# EAGLE design EasyBMS (EAGLE 9.6.2)
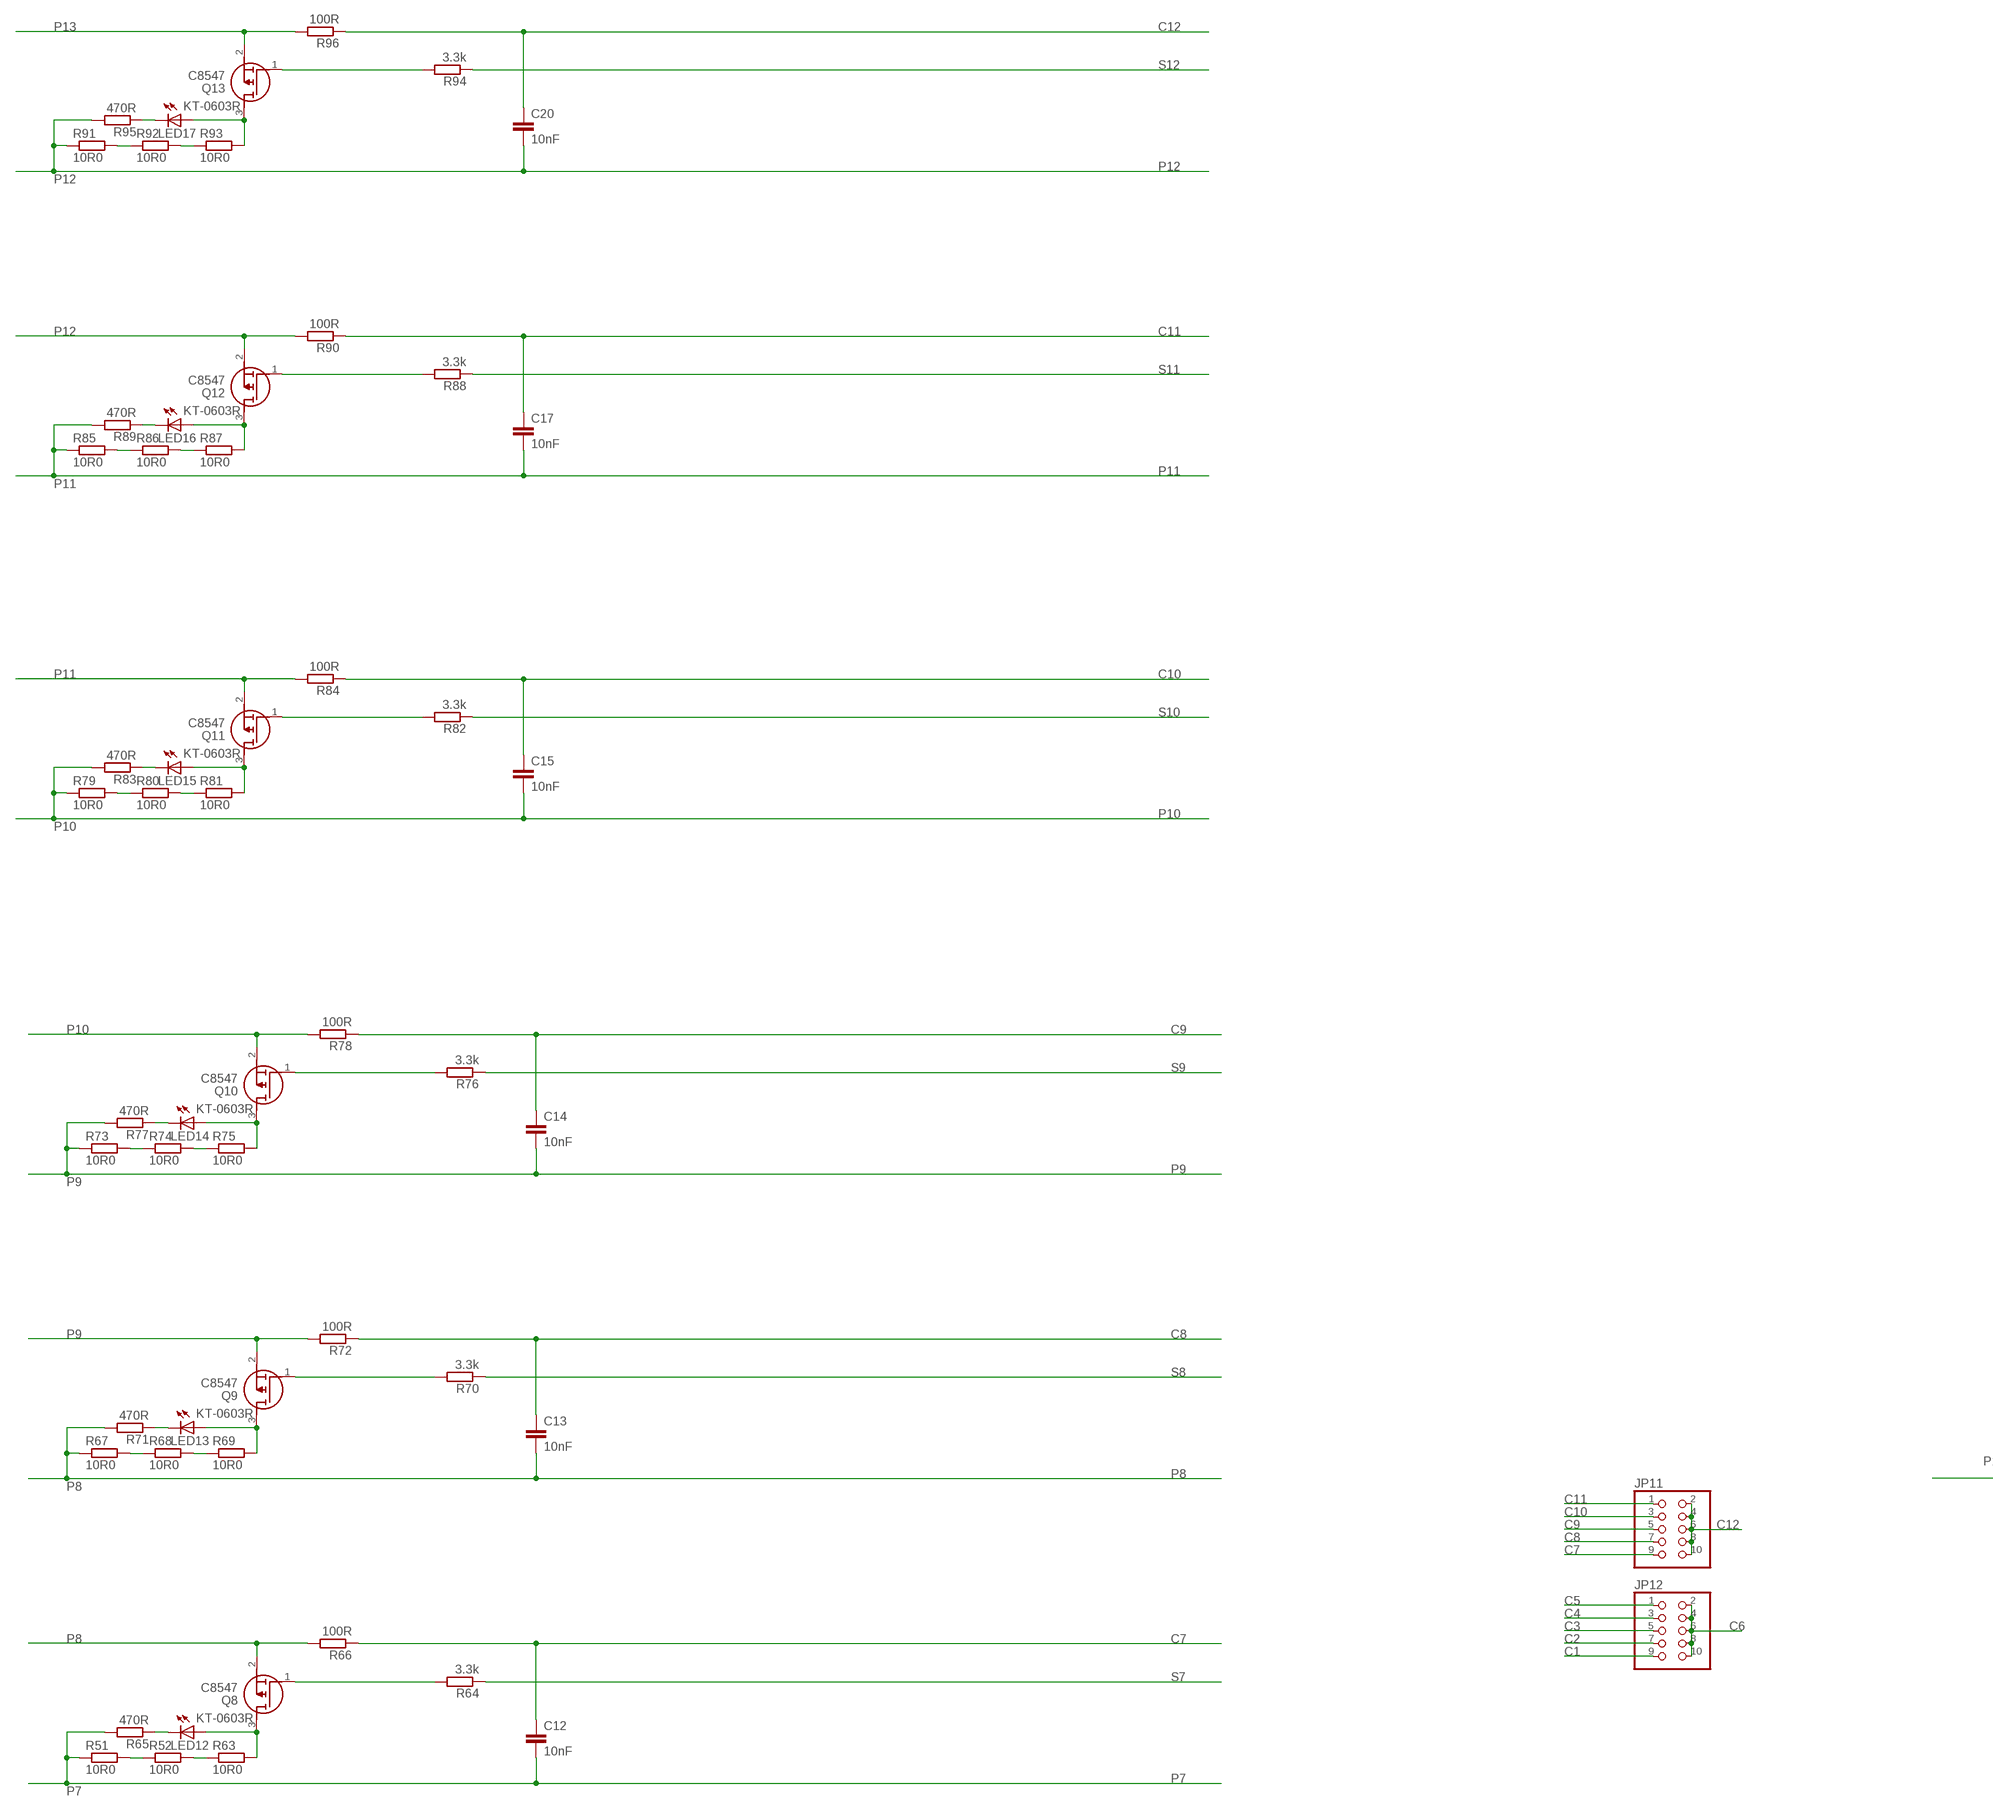
[diagram p0: schematic, sheet 1, part 1 of 3]
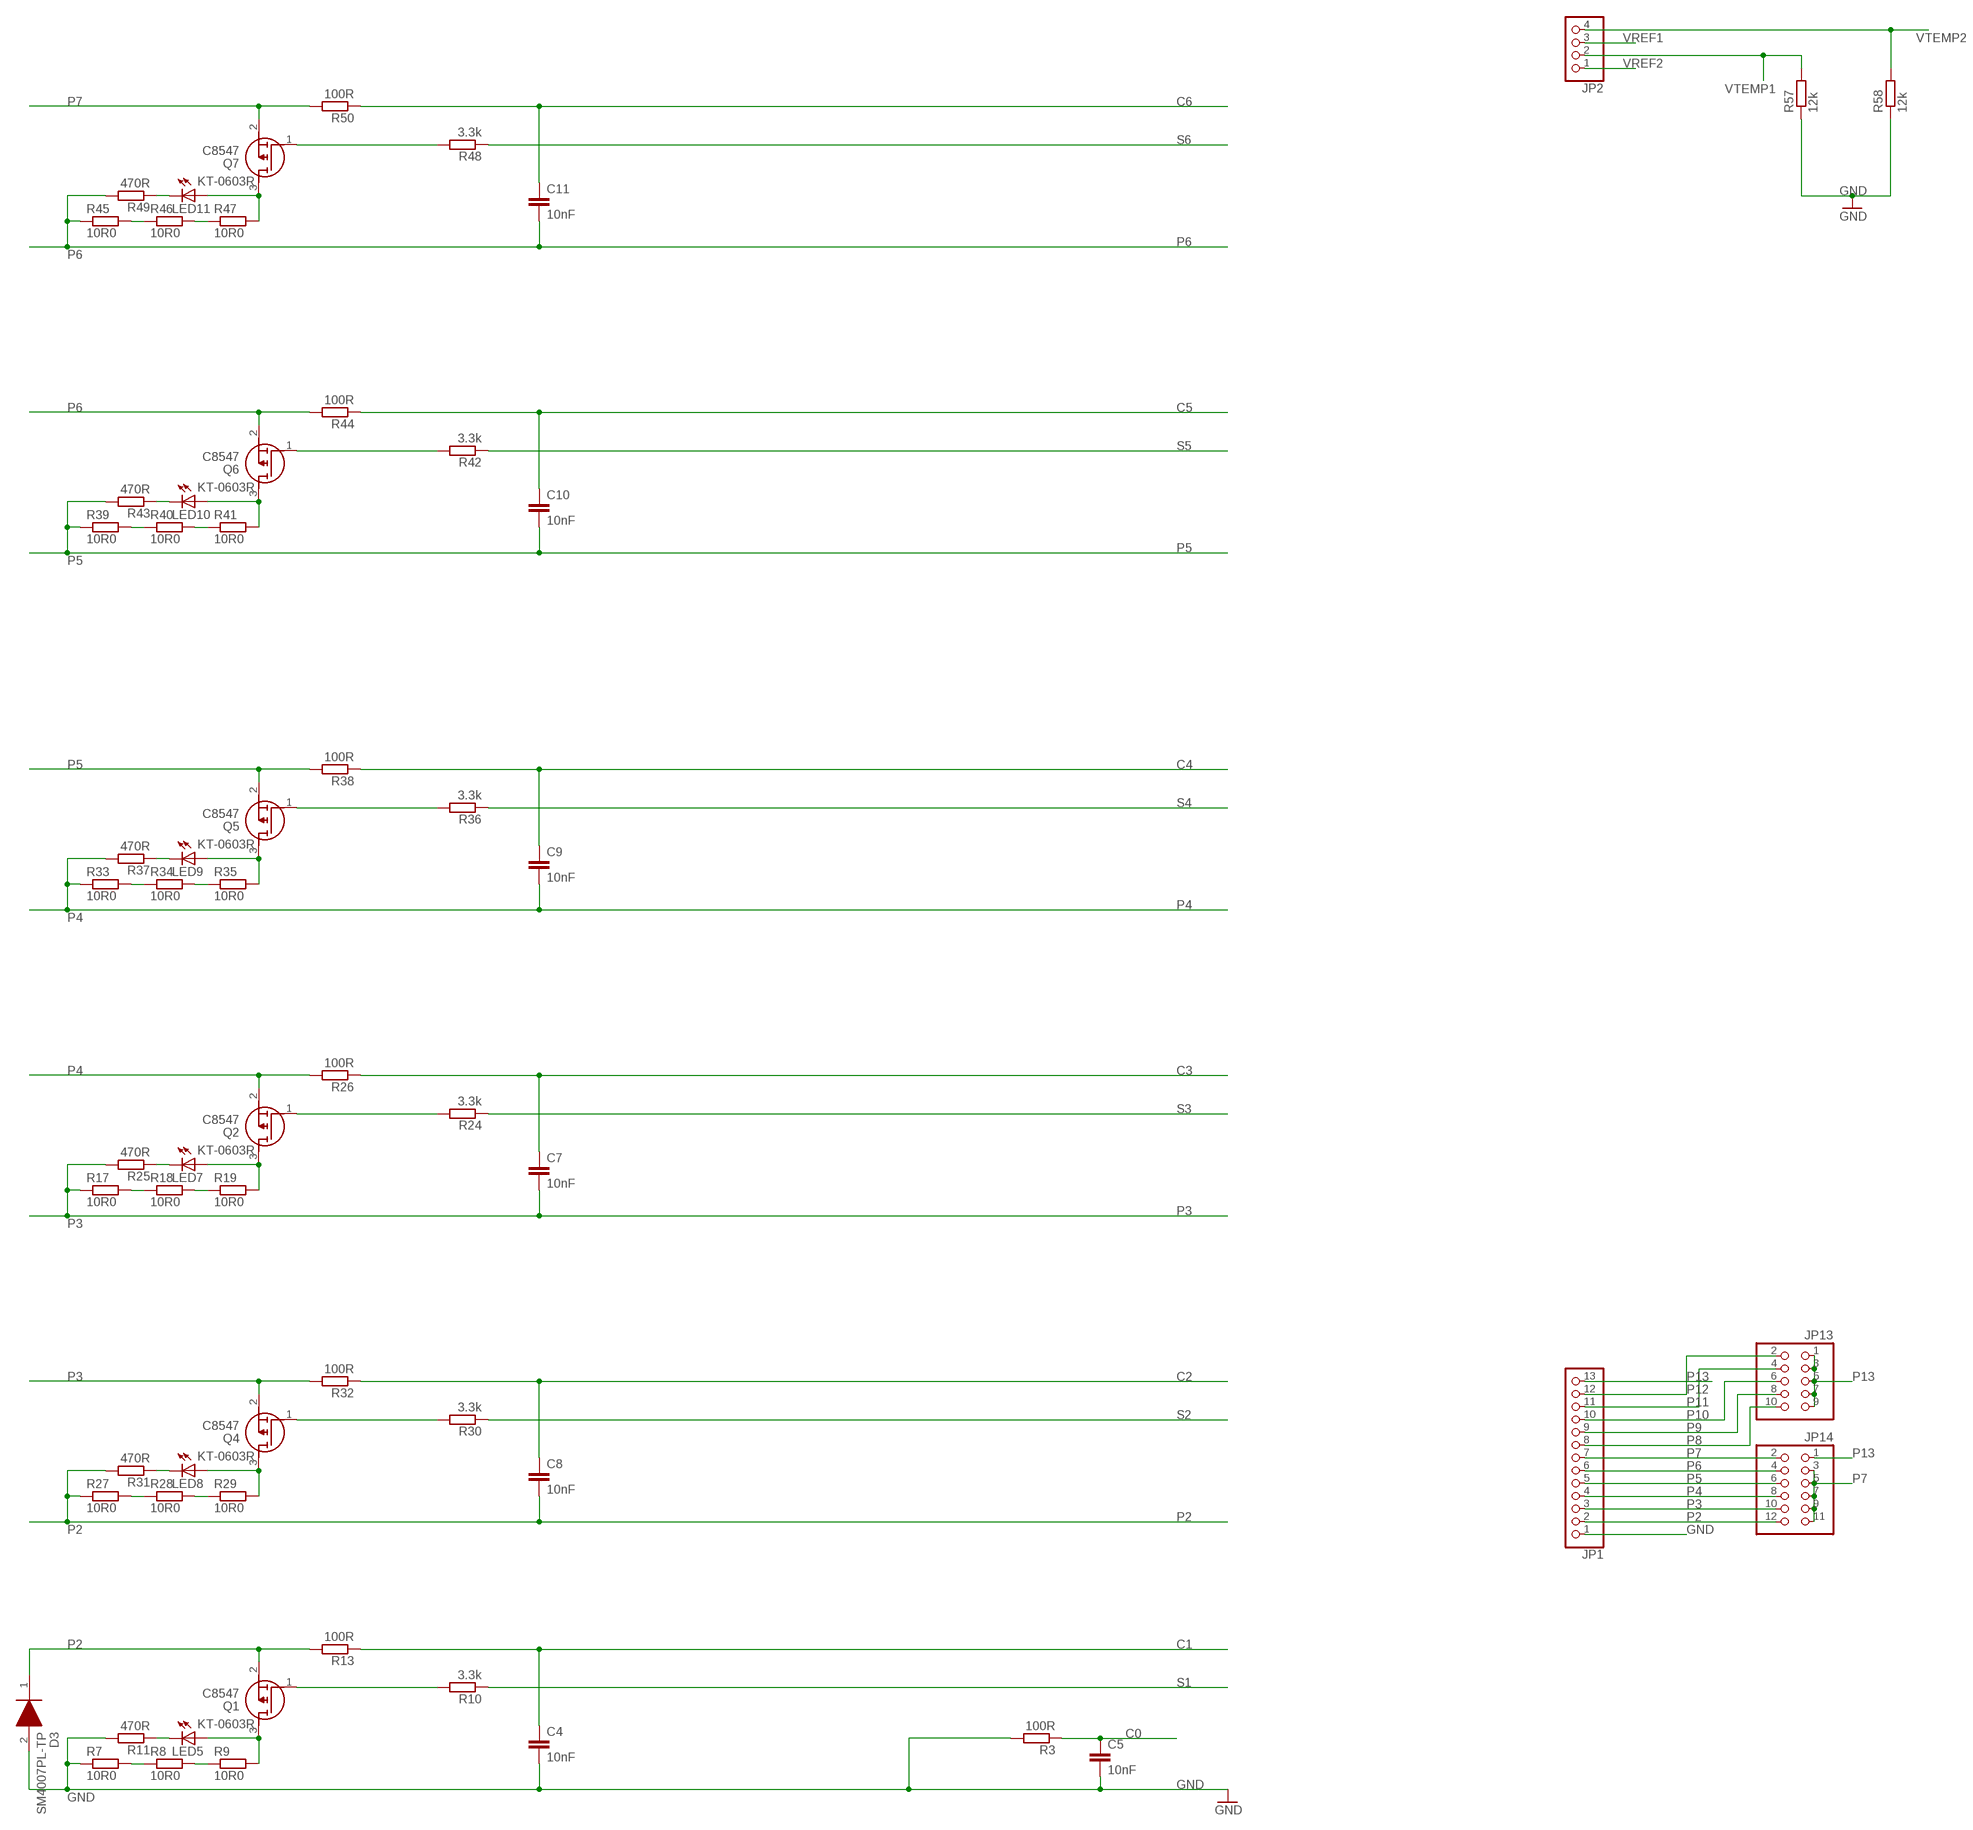
[diagram p1: schematic, sheet 1, part 2 of 3]
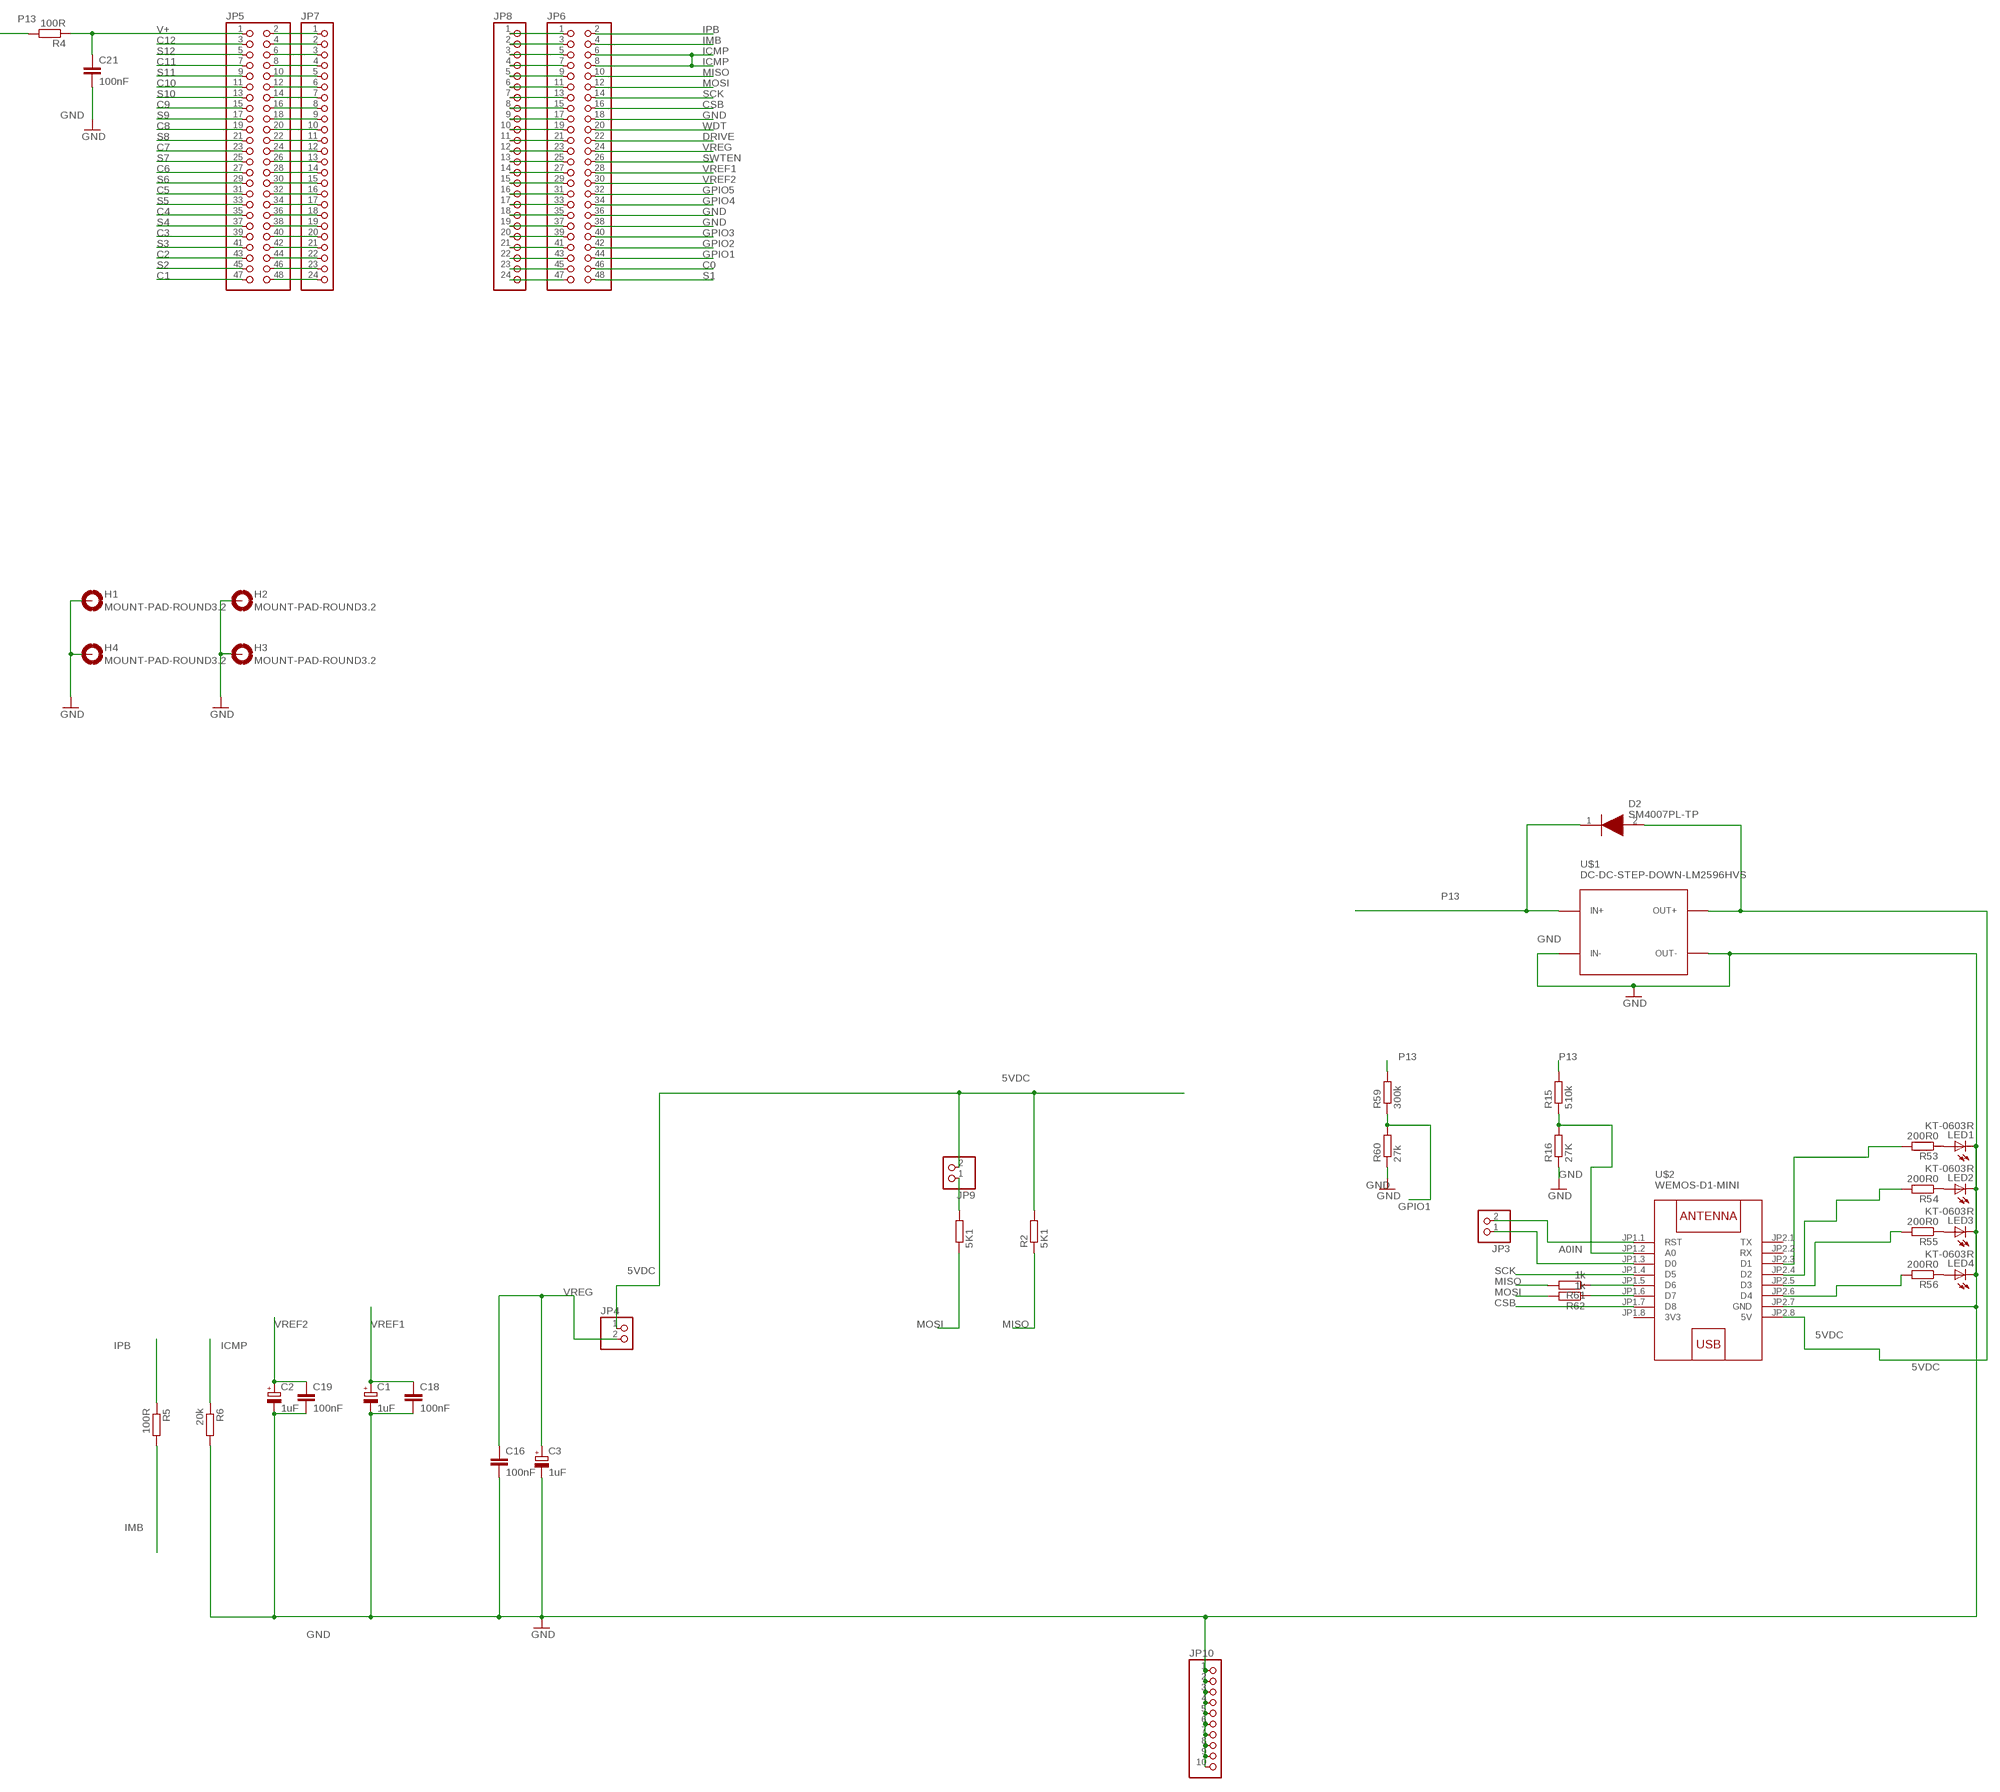
[diagram p2: schematic, sheet 1, part 3 of 3]

## Parts
C1  1uF  CPOL-EUE2.5-6  [E2,5-6]
C2  1uF  CPOL-EUE2.5-6  [E2,5-6]
C3  1uF  CPOL-EUE2.5-6  [E2,5-6]
C4  10nF  C-EUC0402  [C0402]
C5  10nF  C-EUC0402  [C0402]
C7  10nF  C-EUC0402  [C0402]
C8  10nF  C-EUC0402  [C0402]
C9  10nF  C-EUC0402  [C0402]
C10  10nF  C-EUC0402  [C0402]
C11  10nF  C-EUC0402  [C0402]
C12  10nF  C-EUC0402  [C0402]
C13  10nF  C-EUC0402  [C0402]
C14  10nF  C-EUC0402  [C0402]
C15  10nF  C-EUC0402  [C0402]
C16  100nF  C-EUC1206  [C1206]
C17  10nF  C-EUC0402  [C0402]
C18  100nF  C-EUC1206  [C1206]
C19  100nF  C-EUC1206  [C1206]
C20  10nF  C-EUC0402  [C0402]
C21  100nF  C-EUC1206  [C1206]
D2  SM4007PL-TP  [SODFL3616X135N]
D3  SM4007PL-TP  [SODFL3616X135N]
H1  MOUNT-PAD-ROUND3.2  [3,2-PAD]
H2  MOUNT-PAD-ROUND3.2  [3,2-PAD]
H3  MOUNT-PAD-ROUND3.2  [3,2-PAD]
H4  MOUNT-PAD-ROUND3.2  [3,2-PAD]
JP1  PINHD-1X13/90  [1X13/90]
JP2  PINHD-1X4/90  [1X04/90]
JP3  PINHD-1X2  [1X02]
JP4  PINHD-1X2  [1X02]
JP5  PINHD-2X24  [2X24]
JP6  PINHD-2X24  [2X24]
JP7  PINHD-1X24  [1X24]
JP8  PINHD-1X24  [1X24]
JP9  PINHD-1X2  [1X02]
JP10  PINHD-1X10  [1X10]
JP11  PINHD-2X5  [2X05]
JP12  PINHD-2X5  [2X05]
JP13  PINHD-2X5  [2X05]
JP14  PINHD-2X6  [2X06]
LED1  KT-0603R  LEDCHIPLED_0603  [CHIPLED_0603]
LED2  KT-0603R  LEDCHIPLED_0603  [CHIPLED_0603]
LED3  KT-0603R  LEDCHIPLED_0603  [CHIPLED_0603]
LED4  KT-0603R  LEDCHIPLED_0603  [CHIPLED_0603]
LED5  KT-0603R  LEDCHIPLED_0603  [CHIPLED_0603]
LED7  KT-0603R  LEDCHIPLED_0603  [CHIPLED_0603]
LED8  KT-0603R  LEDCHIPLED_0603  [CHIPLED_0603]
LED9  KT-0603R  LEDCHIPLED_0603  [CHIPLED_0603]
LED10  KT-0603R  LEDCHIPLED_0603  [CHIPLED_0603]
LED11  KT-0603R  LEDCHIPLED_0603  [CHIPLED_0603]
LED12  KT-0603R  LEDCHIPLED_0603  [CHIPLED_0603]
LED13  KT-0603R  LEDCHIPLED_0603  [CHIPLED_0603]
LED14  KT-0603R  LEDCHIPLED_0603  [CHIPLED_0603]
LED15  KT-0603R  LEDCHIPLED_0603  [CHIPLED_0603]
LED16  KT-0603R  LEDCHIPLED_0603  [CHIPLED_0603]
LED17  KT-0603R  LEDCHIPLED_0603  [CHIPLED_0603]
Q1  C8547  BSS308PEH6327XTSA1  [PG-SOT-23]
Q2  C8547  BSS308PEH6327XTSA1  [PG-SOT-23]
Q4  C8547  BSS308PEH6327XTSA1  [PG-SOT-23]
Q5  C8547  BSS308PEH6327XTSA1  [PG-SOT-23]
Q6  C8547  BSS308PEH6327XTSA1  [PG-SOT-23]
Q7  C8547  BSS308PEH6327XTSA1  [PG-SOT-23]
Q8  C8547  BSS308PEH6327XTSA1  [PG-SOT-23]
Q9  C8547  BSS308PEH6327XTSA1  [PG-SOT-23]
Q10  C8547  BSS308PEH6327XTSA1  [PG-SOT-23]
Q11  C8547  BSS308PEH6327XTSA1  [PG-SOT-23]
Q12  C8547  BSS308PEH6327XTSA1  [PG-SOT-23]
Q13  C8547  BSS308PEH6327XTSA1  [PG-SOT-23]
R1  5K1  R-EU_R0603  [R0603]
R2  5K1  R-EU_R0603  [R0603]
R3  100R  R-EU_R0402  [R0402]
R4  100R  R-EU_R0402  [R0402]
R5  100R  R-EU_R0402  [R0402]
R6  20k  R-EU_R0603  [R0603]
R7  10R0  R-EU_R1206  [R1206]
R8  10R0  R-EU_R1206  [R1206]
R9  10R0  R-EU_R1206  [R1206]
R10  3.3k  R-EU_R0402  [R0402]
R11  470R  R-EU_R0402  [R0402]
R13  100R  R-EU_R0402  [R0402]
R15  510k  R-EU_R0603  [R0603]
R16  27K  R-EU_R0603  [R0603]
R17  10R0  R-EU_R1206  [R1206]
R18  10R0  R-EU_R1206  [R1206]
R19  10R0  R-EU_R1206  [R1206]
R24  3.3k  R-EU_R0402  [R0402]
R25  470R  R-EU_R0402  [R0402]
R26  100R  R-EU_R0402  [R0402]
R27  10R0  R-EU_R1206  [R1206]
R28  10R0  R-EU_R1206  [R1206]
R29  10R0  R-EU_R1206  [R1206]
R30  3.3k  R-EU_R0402  [R0402]
R31  470R  R-EU_R0402  [R0402]
R32  100R  R-EU_R0402  [R0402]
R33  10R0  R-EU_R1206  [R1206]
R34  10R0  R-EU_R1206  [R1206]
R35  10R0  R-EU_R1206  [R1206]
R36  3.3k  R-EU_R0402  [R0402]
R37  470R  R-EU_R0402  [R0402]
R38  100R  R-EU_R0402  [R0402]
R39  10R0  R-EU_R1206  [R1206]
R40  10R0  R-EU_R1206  [R1206]
R41  10R0  R-EU_R1206  [R1206]
R42  3.3k  R-EU_R0402  [R0402]
R43  470R  R-EU_R0402  [R0402]
R44  100R  R-EU_R0402  [R0402]
R45  10R0  R-EU_R1206  [R1206]
R46  10R0  R-EU_R1206  [R1206]
R47  10R0  R-EU_R1206  [R1206]
R48  3.3k  R-EU_R0402  [R0402]
R49  470R  R-EU_R0402  [R0402]
R50  100R  R-EU_R0402  [R0402]
R51  10R0  R-EU_R1206  [R1206]
R52  10R0  R-EU_R1206  [R1206]
R53  200R0  R-EU_R0603  [R0603]
R54  200R0  R-EU_R0603  [R0603]
R55  200R0  R-EU_R0603  [R0603]
R56  200R0  R-EU_R0603  [R0603]
R57  12k  R-EU_R0603  [R0603]
R58  12k  R-EU_R0603  [R0603]
R59  300k  R-EU_R0603  [R0603]
R60  27k  R-EU_R0603  [R0603]
R61  1k  R-EU_R0603  [R0603]
R62  1k  R-EU_R0603  [R0603]
R63  10R0  R-EU_R1206  [R1206]
R64  3.3k  R-EU_R0402  [R0402]
R65  470R  R-EU_R0402  [R0402]
R66  100R  R-EU_R0402  [R0402]
R67  10R0  R-EU_R1206  [R1206]
R68  10R0  R-EU_R1206  [R1206]
R69  10R0  R-EU_R1206  [R1206]
R70  3.3k  R-EU_R0402  [R0402]
R71  470R  R-EU_R0402  [R0402]
R72  100R  R-EU_R0402  [R0402]
R73  10R0  R-EU_R1206  [R1206]
R74  10R0  R-EU_R1206  [R1206]
R75  10R0  R-EU_R1206  [R1206]
R76  3.3k  R-EU_R0402  [R0402]
R77  470R  R-EU_R0402  [R0402]
R78  100R  R-EU_R0402  [R0402]
R79  10R0  R-EU_R1206  [R1206]
R80  10R0  R-EU_R1206  [R1206]
R81  10R0  R-EU_R1206  [R1206]
R82  3.3k  R-EU_R0402  [R0402]
R83  470R  R-EU_R0402  [R0402]
R84  100R  R-EU_R0402  [R0402]
R85  10R0  R-EU_R1206  [R1206]
R86  10R0  R-EU_R1206  [R1206]
R87  10R0  R-EU_R1206  [R1206]
R88  3.3k  R-EU_R0402  [R0402]
R89  470R  R-EU_R0402  [R0402]
R90  100R  R-EU_R0402  [R0402]
R91  10R0  R-EU_R1206  [R1206]
R92  10R0  R-EU_R1206  [R1206]
R93  10R0  R-EU_R1206  [R1206]
R94  3.3k  R-EU_R0402  [R0402]
R95  470R  R-EU_R0402  [R0402]
R96  100R  R-EU_R0402  [R0402]
U$1  DC-DC-STEP-DOWN-LM2596HVS  [DC-DC-STEP-DOWN-LM2596HVS]
U$2  WEMOS-D1-MINI  [WEMOS-D1-MINI]

## Nets
5VDC: D2.2(A) JP4.1 JP9.2 R2.2 U$1.OUT+ U$2.JP2.8(5V)
A0IN: R15.1 R16.2 U$2.JP1.2(A0)
C0: C5.1 JP6.46 R3.1
C1: C4.1 JP5.47 JP12.9 R13.1
C2: C8.1 JP5.43 JP12.7 R32.1
C3: C7.1 JP5.39 JP12.5 R26.1
C4: C9.1 JP5.35 JP12.3 R38.1
C5: C10.1 JP5.31 JP12.1 R44.1
C6: C11.1 JP5.27 JP12.2 JP12.4 JP12.6 JP12.8 JP12.10 R50.1
C7: C12.1 JP5.23 JP11.9 R66.1
C8: C13.1 JP5.19 JP11.7 R72.1
C9: C14.1 JP5.15 JP11.5 R78.1
C10: C15.1 JP5.11 JP11.3 R84.1
C11: C17.1 JP5.7 JP11.1 R90.1
C12: C20.1 JP5.3 JP11.2 JP11.4 JP11.6 JP11.8 JP11.10 R96.1
CSB: JP6.16 U$2.JP1.7(D8)
DRIVE: JP6.22
GND: C1.- C2.- C3.- C4.2 C5.2 C16.2 C18.2 C19.2 C21.2 D3.2(A) H1.B3,2(MOUNT) H2.B3,2(MOUNT) H3.B3,2(MOUNT) H4.B3,2(MOUNT) JP1.1 JP6.18 JP6.36 JP6.38 JP10.1 JP10.2 JP10.3 JP10.4 JP10.5 JP10.6 JP10.7 JP10.8 JP10.9 JP10.10 LED1.C LED2.C LED3.C LED4.C R3.2 R6.2 R7.1 R11.2 R16.1 R57.1 R58.1 R60.1 U$1.IN- U$1.OUT- U$2.JP2.7(GND)
GPIO1: JP6.44 R59.1 R60.2
GPIO2: JP6.42
GPIO3: JP6.40
GPIO4: JP6.34
GPIO5: JP6.32
ICMP: JP6.6 JP6.8 R6.1
IMB: JP6.4 R5.2
IPB: JP6.2 R5.1
MISO: JP6.10 R2.1 R61.2
MOSI: JP6.12 R1.1 R62.2
N$1: LED1.A R53.1
N$2: LED2.A R54.1
N$3: LED3.A R55.1
N$4: LED4.A R56.1
N$5: JP3.2 U$2.JP1.1(RST)
N$6: JP3.1 U$2.JP1.3(D0)
N$7: JP5.48 JP7.24
N$8: JP5.46 JP7.23
N$9: JP5.44 JP7.22
N$10: JP5.42 JP7.21
N$11: JP5.40 JP7.20
N$12: JP5.38 JP7.19
N$13: JP5.36 JP7.18
N$17: R7.2 R8.1
N$18: R8.2 R9.1
N$21: JP5.34 JP7.17
N$23: LED5.A Q1.3(D) R9.2
N$24: JP5.32 JP7.16
N$25: Q1.1(G) R10.2
N$26: LED5.C R11.1
N$27: R17.2 R18.1
N$28: R18.2 R19.1
N$29: LED7.A Q2.3(D) R19.2
N$30: R56.2 U$2.JP2.6(D4)
N$31: Q2.1(G) R24.2
N$32: LED7.C R25.1
N$33: R27.2 R28.1
N$34: R28.2 R29.1
N$35: LED8.A Q4.3(D) R29.2
N$36: Q4.1(G) R30.2
N$37: LED8.C R31.1
N$38: R33.2 R34.1
N$39: R34.2 R35.1
N$40: LED9.A Q5.3(D) R35.2
N$41: Q5.1(G) R36.2
N$42: LED9.C R37.1
N$43: R39.2 R40.1
N$44: R40.2 R41.1
N$45: LED10.A Q6.3(D) R41.2
N$46: Q6.1(G) R42.2
N$47: LED10.C R43.1
N$48: R45.2 R46.1
N$49: R46.2 R47.1
N$50: LED11.A Q7.3(D) R47.2
N$51: Q7.1(G) R48.2
N$52: LED11.C R49.1
N$53: R51.2 R52.1
N$54: R52.2 R63.1
N$55: LED12.A Q8.3(D) R63.2
N$56: Q8.1(G) R64.2
N$57: LED12.C R65.1
N$58: R67.2 R68.1
N$59: R68.2 R69.1
N$60: LED13.A Q9.3(D) R69.2
N$61: JP5.30 JP7.15
N$62: Q9.1(G) R70.2
N$63: LED13.C R71.1
N$64: R73.2 R74.1
N$65: R74.2 R75.1
N$66: LED14.A Q10.3(D) R75.2
N$67: Q10.1(G) R76.2
N$68: LED14.C R77.1
N$69: R79.2 R80.1
N$70: R53.2 U$2.JP2.3(D1)
N$71: R80.2 R81.1
N$72: LED15.A Q11.3(D) R81.2
N$73: R61.1 U$2.JP1.5(D6)
N$74: JP5.28 JP7.14
N$75: JP5.26 JP7.13
N$76: JP5.24 JP7.12
N$77: JP5.22 JP7.11
N$78: JP5.20 JP7.10
N$79: Q11.1(G) R82.2
N$80: LED15.C R83.1
N$81: R85.2 R86.1
N$82: R86.2 R87.1
N$83: LED16.A Q12.3(D) R87.2
N$84: JP5.18 JP7.9
N$85: JP5.16 JP7.8
N$86: JP5.14 JP7.7
N$87: JP5.12 JP7.6
N$88: JP5.10 JP7.5
N$89: JP5.8 JP7.4
N$90: JP5.6 JP7.3
N$91: JP5.4 JP7.2
N$92: JP6.47 JP8.24
N$93: JP6.45 JP8.23
N$94: JP6.43 JP8.22
N$95: JP6.41 JP8.21
N$96: JP6.39 JP8.20
N$97: JP6.37 JP8.19
N$98: JP6.35 JP8.18
N$99: JP6.33 JP8.17
N$100: JP6.31 JP8.16
N$101: JP6.29 JP8.15
N$102: JP6.27 JP8.14
N$103: JP6.25 JP8.13
N$104: JP6.23 JP8.12
N$105: JP6.21 JP8.11
N$107: JP6.19 JP8.10
N$108: JP6.17 JP8.9
N$109: JP6.15 JP8.8
N$110: JP6.13 JP8.7
N$111: JP6.11 JP8.6
N$112: JP6.9 JP8.5
N$113: JP6.7 JP8.4
N$114: JP6.5 JP8.3
N$115: JP6.3 JP8.2
N$116: JP6.1 JP8.1
N$117: JP9.1 R1.2
N$118: JP5.2 JP7.1
N$119: R62.1 U$2.JP1.6(D7)
N$120: R55.2 U$2.JP2.5(D3)
N$122: Q12.1(G) R88.2
N$123: LED16.C R89.1
N$124: R54.2 U$2.JP2.4(D2)
N$125: R91.2 R92.1
N$126: R92.2 R93.1
N$127: LED17.A Q13.3(D) R93.2
N$128: Q13.1(G) R94.2
N$129: LED17.C R95.1
P2: C8.2 D3.1(K) JP1.2 JP14.12 Q1.2(S) R13.2 R27.1 R31.2
P3: C7.2 JP1.3 JP14.10 Q4.2(S) R17.1 R25.2 R32.2
P4: C9.2 JP1.4 JP14.8 Q2.2(S) R26.2 R33.1 R37.2
P5: C10.2 JP1.5 JP14.6 Q5.2(S) R38.2 R39.1 R43.2
P6: C11.2 JP1.6 JP14.4 Q6.2(S) R44.2 R45.1 R49.2
P7: C12.2 JP1.7 JP14.2 JP14.3 JP14.5 JP14.7 JP14.9 JP14.11 Q7.2(S) R50.2 R51.1 R65.2
P8: C13.2 JP1.8 JP13.10 Q8.2(S) R66.2 R67.1 R71.2
P9: C14.2 JP1.9 JP13.8 Q9.2(S) R72.2 R73.1 R77.2
P10: C15.2 JP1.10 JP13.6 Q10.2(S) R78.2 R79.1 R83.2
P11: C17.2 JP1.11 JP13.4 Q11.2(S) R84.2 R85.1 R89.2
P12: C20.2 JP1.12 JP13.2 Q12.2(S) R90.2 R91.1 R95.2
P13: D2.1(K) JP1.13 JP13.1 JP13.3 JP13.5 JP13.7 JP13.9 JP14.1 Q13.2(S) R4.2 R15.2 R59.2 R96.2 U$1.IN+
S1: JP6.48 R10.1
S2: JP5.45 R30.1
S3: JP5.41 R24.1
S4: JP5.37 R36.1
S5: JP5.33 R42.1
S6: JP5.29 R48.1
S7: JP5.25 R64.1
S8: JP5.21 R70.1
S9: JP5.17 R76.1
S10: JP5.13 R82.1
S11: JP5.9 R88.1
S12: JP5.5 R94.1
SCK: JP6.14 U$2.JP1.4(D5)
SWTEN: JP6.26
V+: C21.1 JP5.1 R4.1
VREF1: C1.+ C18.1 JP2.3 JP6.28
VREF2: C2.+ C19.1 JP2.1 JP6.30
VREG: C3.+ C16.1 JP4.2 JP6.24
VTEMP1: JP2.2 R57.2
VTEMP2: JP2.4 R58.2
WDT: JP6.20
Unconnected: U$2.JP2.1(TX) U$2.JP2.2(RX)

## Power pins joined to a net without a drawn wire
3V3: U$2.JP1.8(3V3)

## Library data of the parts
C1-C3 = rcl:CPOL-EU: POLARIZED CAPACITOR, European symbol
C4 C5 C7-C21 = rcl:C-EU: CAPACITOR, European symbol
D2 D3 = SamacSys_Parts:SM4007PL-TP: Rectifiers 1A, 1000V 1A, 1000V Source: Datasheet <http://www.mccsemi.com/up_pdf/SM4001PL-SM4007PL(SOD-123FL).PDF>; DESCRIPTION: Rectifiers 1A, 1000V 1A, 1000V; HEIGHT: 1.35mm; MANUFACTURER_NAME: Micro Commercial Components (MCC); MANUFACTURER_PART_NUMBER: SM4007PL-TP; MOUSER_PART_NUMBER: 833-SM4007PL-TP; MOUSER_PRICE-STOCK: https://www.mouser.co.uk/ProductDetail/Micro-Commercial-Components-MCC/SM4007PL-TP?qs=SdqRYZZ9IxCh9ylwm1K3UA%3D%3D
H1-H4 = holes:MOUNT-PAD-ROUND: MOUNTING PAD, round
JP1 = pinhead:PINHD-1X13: PIN HEADER
JP2 = pinhead:PINHD-1X4: PIN HEADER
JP3 JP4 JP9 = pinhead_own:PINHD-1X2: PIN HEADER
JP5 JP6 = pinhead:PINHD-2X24: PIN HEADER
JP7 JP8 = pinhead:PINHD-1X24: PIN HEADER
JP10 = pinhead:PINHD-1X10: PIN HEADER
JP11-JP13 = pinhead:PINHD-2X5: PIN HEADER
JP14 = pinhead:PINHD-2X6: PIN HEADER
LED1-LED5 LED7-LED17 = led:LED: LED OSRAM: - CHIPLED LG R971, LG N971, LY N971, LG Q971, LY Q971, LO R971, LY R971 LH N974, LH R974 LS Q976, LO Q976, LY Q976 LO Q996 - Hyper CHIPLED LW Q18S LB Q993, LB Q99A, LB R99A - SideLED LS A670, LO A670, LY A670, LG A670, LP A670 LB A673, LV A673, LT A673, LW A673 LH A674 LY A675 LS A676, LA A676, LO A676, LY A676, LW A676 LS A679, LY A679, LG A679 - Hyper Micro SIDELED® LS Y876, LA Y876, LO Y876, LY Y876 LT Y87S - SmartLED LW L88C, LW L88S LB L89C, LB L89S, LG L890 LS L89K, LO L89K, LY L89K LS L896, LA L896, LO L896, LY L896 - TOPLED LS T670, LO T670, LY T670, LG T670, LP T670 LSG T670, LSP T670, LSY T670, LOP T670, LYG T670 LG T671, LOG T671, LSG T671 LB T673, LV T673, LT T673, LW T673 LH T674 LS T676, LA T676, LO T676, LY T676, LB T676, LH T676, LSB T676, LW T676 LB T67C, LV T67C, LT T67C, LS T67K, LO T67K, LY T67K, LW E67C LS E67B, LA E67B, LO E67B, LY E67B, LB E67C, LV E67C, LT E67C LW T67C LS T679, LY T679, LG T679 LS T770, LO T770, LY T770, LG T770, LP T770 LB T773, LV T773, LT T773, LW T773 LH T774 LS E675, LA E675, LY E675, LS T675 LS T776, LA T776, LO T776, LY T776, LB T776 LHGB T686 LT T68C, LB T68C - Hyper Mini TOPLED® LB M676 - Mini TOPLED Santana® LG M470 LS M47K, LO M47K, LY M47K Source: http://www.osram.convergy.de LUXEON: - LUMILED® LXK2-PW12-R00, LXK2-PW12-S00, LXK2-PW14-U00, LXK2-PW14-V00 LXK2-PM12-R00, LXK2-PM12-S00, LXK2-PM14-U00 LXK2-PE12-Q00, LXK2-PE12-R00, LXK2-PE12-S00, LXK2-PE14-T00, LXK2-PE14-U00 LXK2-PB12-K00, LXK2-PB12-L00, LXK2-PB12-M00, LXK2-PB14-N00, LXK2-PB14-P00, LXK2-PB14-Q00 LXK2-PR12-L00, LXK2-PR12-M00, LXK2-PR14-Q00, LXK2-PR14-R00 LXK2-PD12-Q00, LXK2-PD12-R00, LXK2-PD12-S00 LXK2-PH12-R00, LXK2-PH12-S00 LXK2-PL12-P00, LXK2-PL12-Q00, LXK2-PL12-R00 Source: www.luxeon.com KINGBRIGHT: KA-3528ASYC Source: www.kingbright.com
Q1 Q2 Q4-Q13 = SamacSys_Parts:BSS308PEH6327XTSA1: Infineon BSS308PEH6327XTSA1 P-channel MOSFET, 1.6 A, 30 V OptiMOS P, 3-Pin SOT-23 Source: Datasheet <https://www.infineon.com/dgdl/Infineon-BSS308PE-DS-v02_03-en.pdf?fileId=db3a304330f686060131099c80400073>; DESCRIPTION: Infineon BSS308PEH6327XTSA1 P-channel MOSFET, 1.6 A, 30 V OptiMOS P, 3-Pin SOT-23; HEIGHT: mm; MANUFACTURER_NAME: Infineon; MANUFACTURER_PART_NUMBER: BSS308PEH6327XTSA1; MOUSER_PART_NUMBER: 726-BSS308PEH6327XTS; MOUSER_PRICE-STOCK: https://www.mouser.co.uk/ProductDetail/Infineon-Technologies/BSS308PEH6327XTSA1?qs=K00xGehIljswKa%252BUULwt9w%3D%3D
R1-R11 R13 R15-R19 R24-R96 = rcl:R-EU_: RESISTOR, European symbol
U$1 = diy-modules:DC-DC-STEP-DOWN-LM2596HVS: DC/DC Step-Down Regulator based on LM2596-ADJ chip LM2596 datasheet available here: http://www.ti.com/lit/ds/symlink/lm2596.pdf Click here to find device on ebay.com <http://www.ebay.com/sch/lm2596+power+regulator>
U$2 = diy-modules:WEMOS-D1-MINI: WEMOS D1 mini: Mini Wi-Fi Board based on ESP-8266 device More details can be found here: https://www.wemos.cc/product/d1-mini.html Click here to find device on ebay.com <http://www.ebay.com/sch/wemos+d1+mini+nodemcu>

## Board
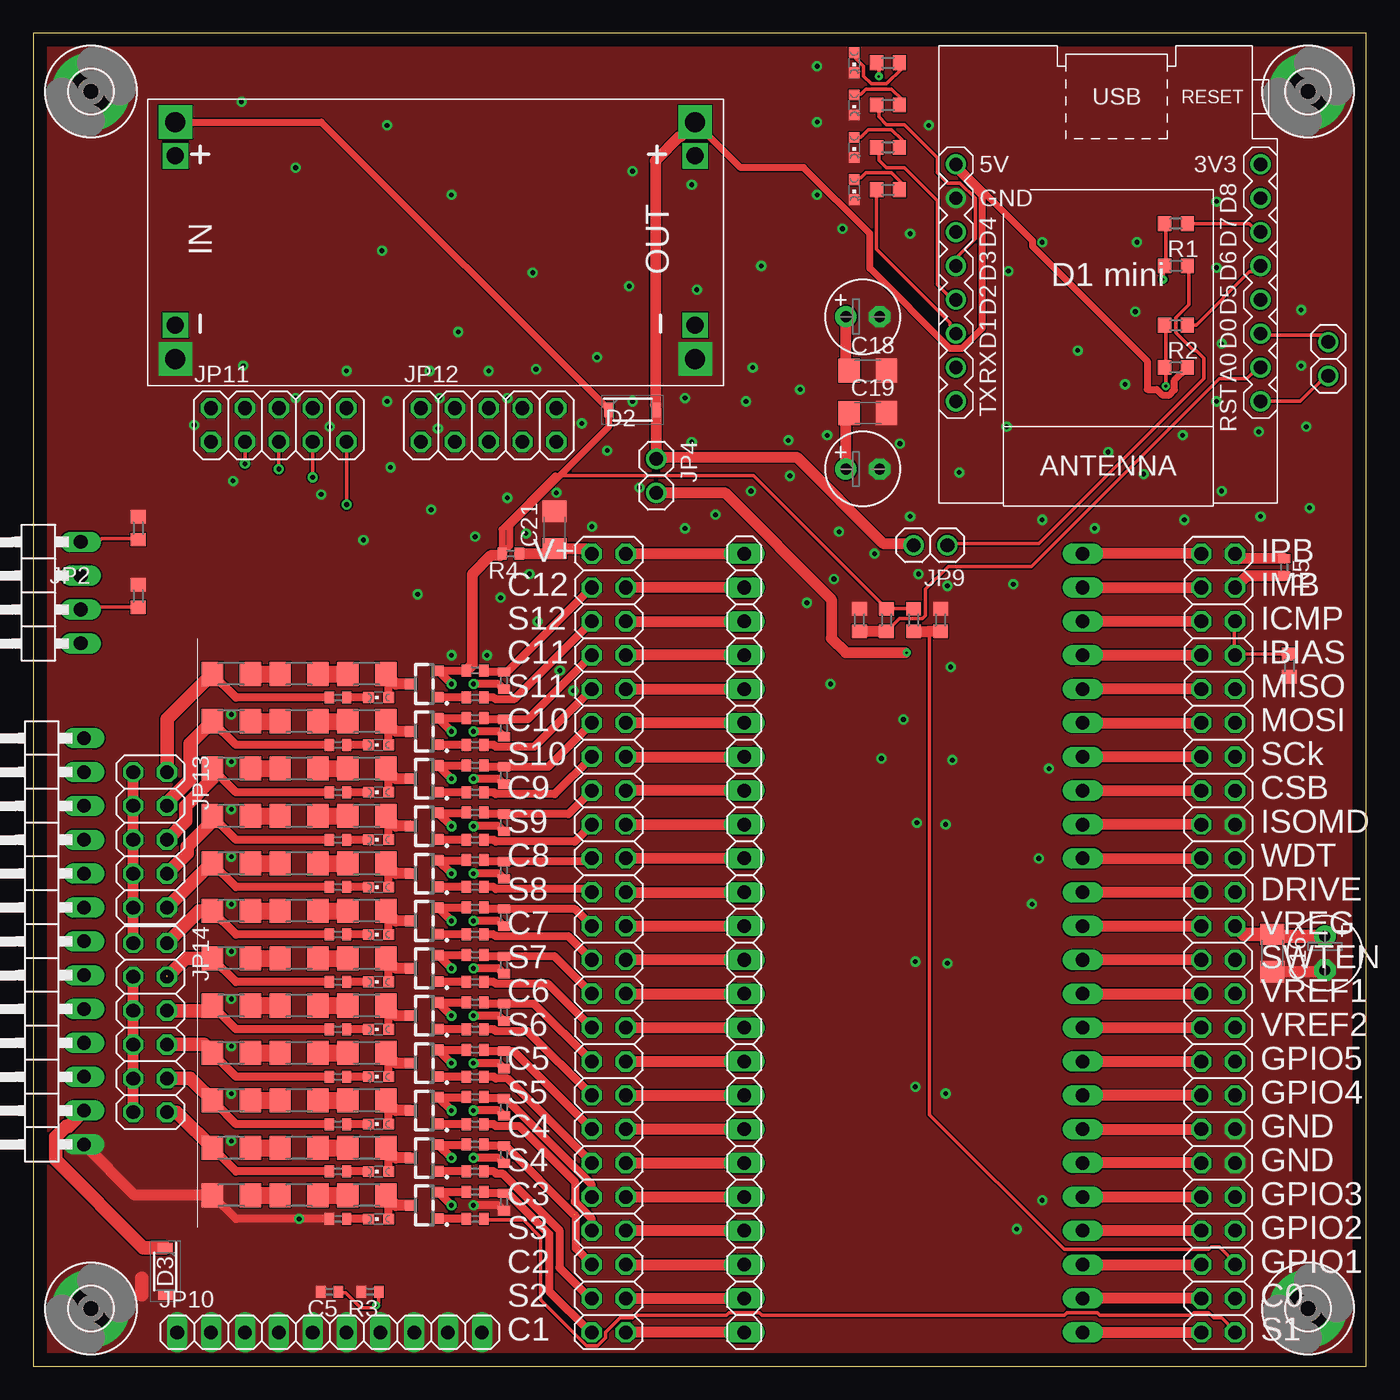
[diagram p3: board, top side]
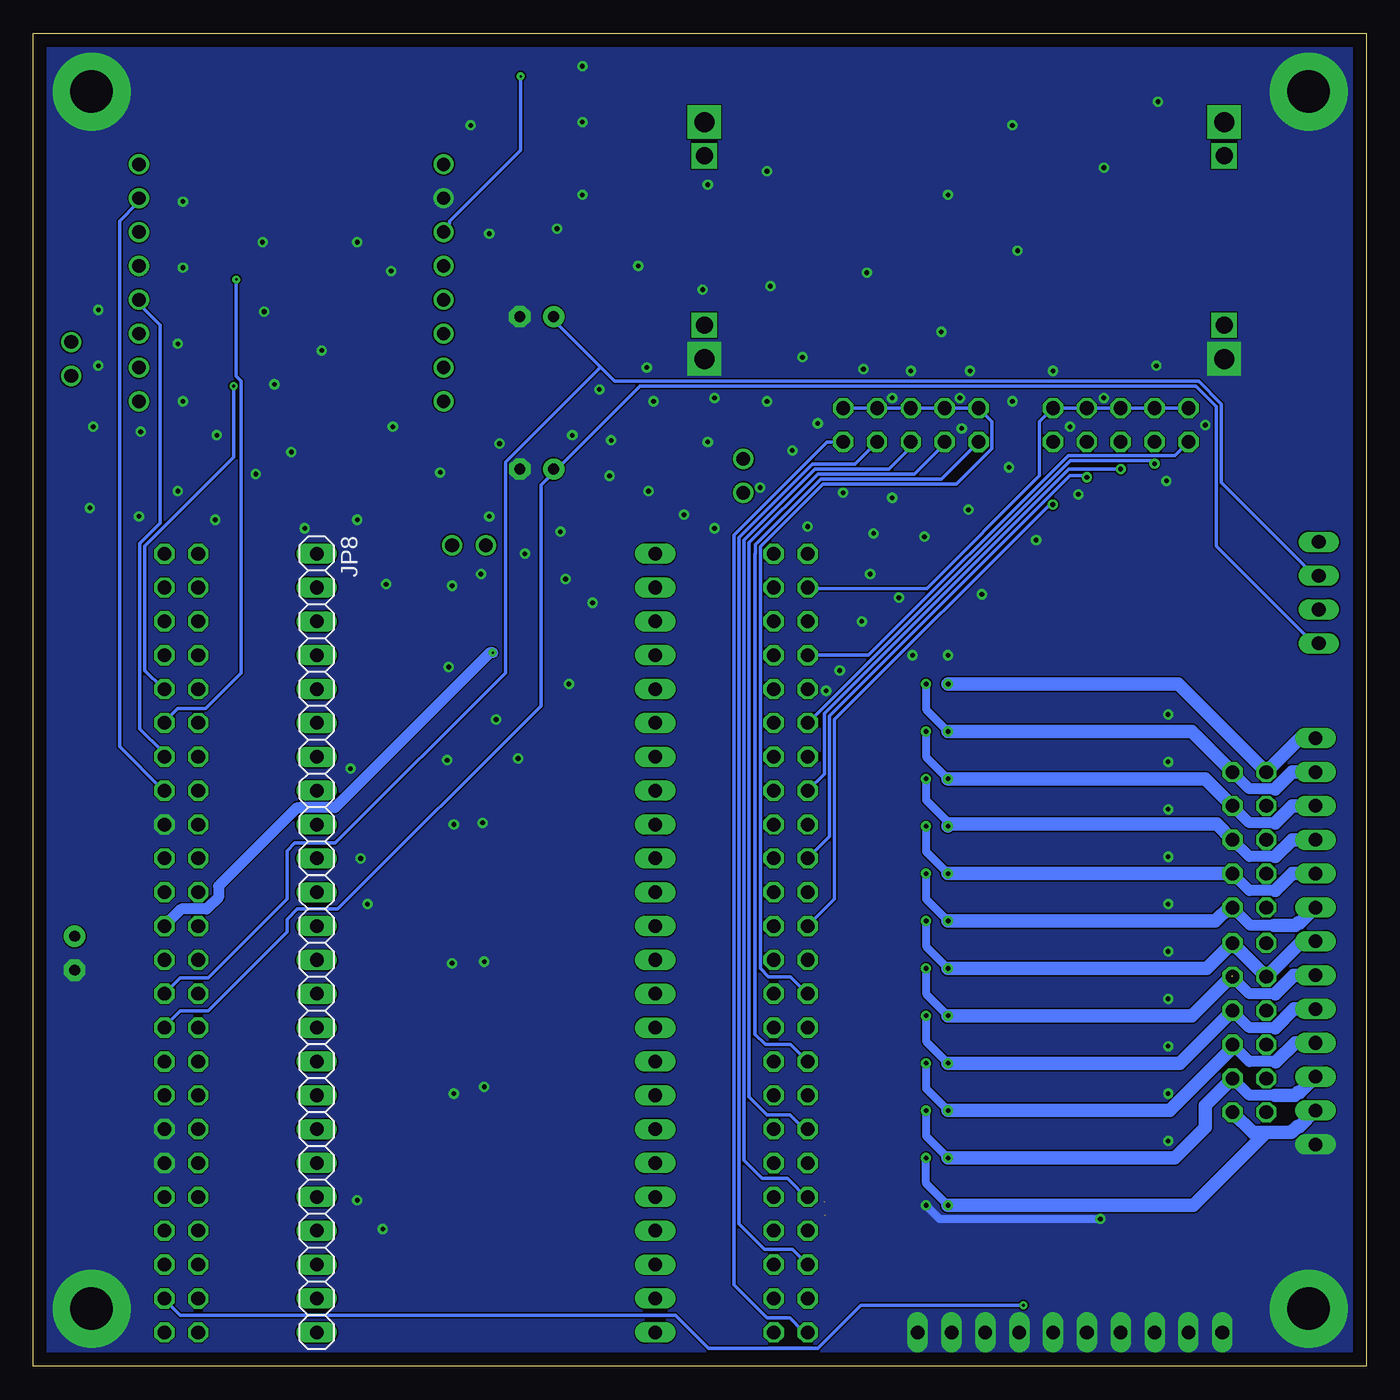
[diagram p4: board, bottom side, seen from below]

Size 100 x 100 mm. Coordinates in mm from the lower left corner, seen from the top.
Outline: 0,100 0,0 100,0 100,100 0,100
Copper layers (1*16): Top 0.035mm / dielectric 1.5mm / Bottom 0.035mm
Design rules "default *": minimum track width 11mil, minimum drill 0.2mm, track to track 4mil, track to pad 4mil, pad to pad 4mil, via to via 4mil, smd to smd 4mil, copper to edge 40mil, drill to drill 6mil, minimum pad ring 10mil, minimum via ring 8mil, stop-mask expansion 4mil, vias tented up to drill 0mil, thermal gap 10mil

### Footprints (pad centres in the part's own frame; a part is rotated, then mirrored left to right if it is on the bottom)
E2,5-6 = drill 0.813 pad 1.6: + -1.27,0 | drill 0.813 pad 1.6 octagon: - 1.27,0
C0402 = smd 0.7 x 0.9: 1 -0.65,0; 2 0.65,0
C1206 = smd 1.6 x 1.8: 1 -1.4,0; 2 1.4,0
SODFL3616X135N = smd 0.74 x 1.07: 1 -1.775,0; 2 1.775,0
3,2-PAD = drill 3.2 pad 5.842: B3,2 0,0
1X13/90 = drill 1.016 long: 1 -15.24,-3.81; 2 -12.7,-3.81; 3 -10.16,-3.81; 4 -7.62,-3.81; 5 -5.08,-3.81; 6 -2.54,-3.81; 7 0,-3.81; 8 2.54,-3.81; 9 5.08,-3.81; 10 7.62,-3.81; 11 10.16,-3.81; 12 12.7,-3.81; 13 15.24,-3.81
1X04/90 = drill 1.016 long: 1 -3.81,-3.81; 2 -1.27,-3.81; 3 1.27,-3.81; 4 3.81,-3.81
1X02 = drill 1.016: 1 -1.27,0; 2 1.27,0
2X24 = drill 1.016 octagon: 1 -27.94,-1.27; 2 -27.94,1.27; 3 -25.4,-1.27; 4 -25.4,1.27; 5 -22.86,-1.27; 6 -22.86,1.27; 7 -20.32,-1.27; 8 -20.32,1.27; 9 -17.78,-1.27; 10 -17.78,1.27; 11 -15.24,-1.27; 12 -15.24,1.27; 13 -12.7,-1.27; 14 -12.7,1.27; 15 -10.16,-1.27; 16 -10.16,1.27; 17 -7.62,-1.27; 18 -7.62,1.27; 19 -5.08,-1.27; 20 -5.08,1.27; 21 -2.54,-1.27; 22 -2.54,1.27; 23 0,-1.27; 24 0,1.27; 25 2.54,-1.27; 26 2.54,1.27; 27 5.08,-1.27; 28 5.08,1.27; 29 7.62,-1.27; 30 7.62,1.27; 31 10.16,-1.27; 32 10.16,1.27; 33 12.7,-1.27; 34 12.7,1.27; 35 15.24,-1.27; 36 15.24,1.27; 37 17.78,-1.27; 38 17.78,1.27; 39 20.32,-1.27; 40 20.32,1.27; 41 22.86,-1.27; 42 22.86,1.27; 43 25.4,-1.27; 44 25.4,1.27; 45 27.94,-1.27; 46 27.94,1.27; 47 30.48,-1.27; 48 30.48,1.27
1X24 = drill 1.016 long: 1 -29.21,0; 2 -26.67,0; 3 -24.13,0; 4 -21.59,0; 5 -19.05,0; 6 -16.51,0; 7 -13.97,0; 8 -11.43,0; 9 -8.89,0; 10 -6.35,0; 11 -3.81,0; 12 -1.27,0; 13 1.27,0; 14 3.81,0; 15 6.35,0; 16 8.89,0; 17 11.43,0; 18 13.97,0; 19 16.51,0; 20 19.05,0; 21 21.59,0; 22 24.13,0; 23 26.67,0; 24 29.21,0
1X10 = drill 1.016 long: 1 -11.43,0; 2 -8.89,0; 3 -6.35,0; 4 -3.81,0; 5 -1.27,0; 6 1.27,0; 7 3.81,0; 8 6.35,0; 9 8.89,0; 10 11.43,0
2X05 = drill 1.016 octagon: 1 -5.08,-1.27; 2 -5.08,1.27; 3 -2.54,-1.27; 4 -2.54,1.27; 5 0,-1.27; 6 0,1.27; 7 2.54,-1.27; 8 2.54,1.27; 9 5.08,-1.27; 10 5.08,1.27
2X06 = drill 1.016 octagon: 1 -6.35,-1.27; 2 -6.35,1.27; 3 -3.81,-1.27; 4 -3.81,1.27; 5 -1.27,-1.27; 6 -1.27,1.27; 7 1.27,-1.27; 8 1.27,1.27; 9 3.81,-1.27; 10 3.81,1.27; 11 6.35,-1.27; 12 6.35,1.27
CHIPLED_0603 = smd 0.8 x 0.8: A 0,-0.75; C 0,0.75
PG-SOT-23 = smd 0.9 x 0.8: 1 1,-1; 2 1,1; 3 -1,0
R0603 = smd 1 x 1.1: 1 -0.85,0; 2 0.85,0
R0402 = smd 0.7 x 0.9: 1 -0.65,0; 2 0.65,0
R1206 = smd 1.6 x 1.803: 1 -1.422,0; 2 1.422,0
DC-DC-STEP-DOWN-LM2596HVS = drill 1.5 pad 2.5 square: IN+ 0,17.78; IN- 0,0; OUT+ 39,17.78; OUT- 39,0 | drill 1.27 pad 1.676 square: P$1 0,15.24; P$6 0,2.54; P$7 39,15.24; P$8 39,2.54
WEMOS-D1-MINI = drill 1: JP1.1 -11.43,9.525; JP1.2 -11.43,6.985; JP1.3 -11.43,4.445; JP1.4 -11.43,1.905; JP1.5 -11.43,-0.635; JP1.6 -11.43,-3.175; JP1.7 -11.43,-5.715; JP1.8 -11.43,-8.255; JP2.1 11.43,9.525; JP2.2 11.43,6.985; JP2.3 11.43,4.445; JP2.4 11.43,1.905; JP2.5 11.43,-0.635; JP2.6 11.43,-3.175; JP2.7 11.43,-5.715; JP2.8 11.43,-8.255

### Placement (x,y rotation side)
C1  62.23,78.74 0 top
C2  62.23,67.31 0 top
C3  96.9,30.99 270 top
C4  35.31,12.32 270 top
C5  22.23,5.59 180 top
C7  35.31,19.43 270 top
C8  35.31,15.88 270 top
C9  35.31,22.99 270 top
C10  35.31,26.54 270 top
C11  35.31,30.1 270 top
C12  35.31,33.66 270 top
C13  35.31,37.21 270 top
C14  35.31,40.77 270 top
C15  35.31,44.32 270 top
C16  92.96,30.99 270 top
C17  35.31,47.88 270 top
C18  62.61,74.68 0 top
C19  62.61,71.5 0 top
C20  35.31,51.44 270 top
C21  39.12,62.74 90 top
D2  44.96,71.75 0 top
D3  9.91,7.11 270 top
H1  4.32,95.63 0 top
H2  95.63,95.63 0 top
H3  4.32,4.32 0 top
H4  95.63,4.32 0 top
JP1  0,31.88 90 top
JP2  -0.25,58.04 90 top
JP3  97.16,75.56 270 top
JP4  46.74,66.8 270 top
JP5  43.18,33.02 270 top
JP6  88.9,33.02 270 top
JP7  53.34,31.75 270 top
JP8  78.74,31.75 270 bottom
JP9  67.31,61.59 180 top
JP10  22.23,2.54 0 top
JP11  18.41,70.61 0 top
JP12  34.16,70.61 0 top
JP13  8.76,39.5 270 top
JP14  8.76,25.4 270 top
LED1  61.59,88.27 180 top
LED2  61.59,91.44 180 top
LED3  61.59,94.61 180 top
LED4  61.59,97.79 180 top
LED5  25.91,11.05 90 top
LED7  25.91,18.16 90 top
LED8  25.91,14.61 90 top
LED9  25.91,21.72 90 top
LED10  25.91,25.27 90 top
LED11  25.91,28.83 90 top
LED12  25.91,32.38 90 top
LED13  25.91,35.94 90 top
LED14  25.91,39.5 90 top
LED15  25.91,43.05 90 top
LED16  25.91,46.61 90 top
LED17  25.91,50.16 90 top
Q1  29.34,12.06 0 top
Q2  29.34,19.18 0 top
Q4  29.34,15.62 0 top
Q5  29.34,22.73 0 top
Q6  29.34,26.29 0 top
Q7  29.34,29.84 0 top
Q8  29.34,33.4 0 top
Q9  29.34,36.96 0 top
Q10  29.34,40.51 0 top
Q11  29.34,44.07 0 top
Q12  29.34,47.62 0 top
Q13  29.34,51.18 0 top
R1  85.72,82.55 0 top
R2  85.72,74.93 0 top
R3  25.27,5.59 180 top
R4  35.81,60.96 180 top
R5  93.85,59.94 270 top
R6  94.23,52.58 270 top
R7  14.86,12.83 0 top
R8  19.94,12.83 0 top
R9  25.02,12.83 0 top
R10  33.15,11.05 180 top
R11  22.86,11.05 180 top
R13  33.15,13.08 180 top
R15  64.01,55.98 90 top
R16  61.98,55.98 270 top
R17  14.86,19.94 0 top
R18  19.94,19.94 0 top
R19  25.02,19.94 0 top
R24  33.15,18.16 180 top
R25  22.86,18.16 180 top
R26  33.15,20.19 180 top
R27  14.86,16.38 0 top
R28  19.94,16.38 0 top
R29  25.02,16.38 0 top
R30  33.15,14.61 180 top
R31  22.86,14.61 180 top
R32  33.15,16.64 180 top
R33  14.86,23.5 0 top
R34  19.94,23.5 0 top
R35  25.02,23.5 0 top
R36  33.15,21.72 180 top
R37  22.86,21.72 180 top
R38  33.15,23.75 180 top
R39  14.86,27.05 0 top
R40  19.94,27.05 0 top
R41  25.02,27.05 0 top
R42  33.15,25.27 180 top
R43  22.86,25.27 180 top
R44  33.15,27.3 180 top
R45  14.86,30.61 0 top
R46  19.94,30.61 0 top
R47  25.02,30.61 0 top
R48  33.15,28.83 180 top
R49  22.86,28.83 180 top
R50  33.15,30.86 180 top
R51  14.86,34.16 0 top
R52  19.94,34.16 0 top
R53  64.14,88.27 180 top
R54  64.14,91.44 180 top
R55  64.14,94.61 180 top
R56  64.14,97.79 180 top
R57  7.87,57.78 270 top
R58  7.87,62.87 270 top
R59  66.04,55.98 90 top
R60  68.07,55.98 270 top
R61  85.72,78.11 180 top
R62  85.72,85.72 180 top
R63  25.02,34.16 0 top
R64  33.15,32.38 180 top
R65  22.86,32.38 180 top
R66  33.15,34.42 180 top
R67  14.86,37.72 0 top
R68  19.94,37.72 0 top
R69  25.02,37.72 0 top
R70  33.15,35.94 180 top
R71  22.86,35.94 180 top
R72  33.15,37.97 180 top
R73  14.86,41.27 0 top
R74  19.94,41.27 0 top
R75  25.02,41.27 0 top
R76  33.15,39.5 180 top
R77  22.86,39.5 180 top
R78  33.15,41.53 180 top
R79  14.86,44.83 0 top
R80  19.94,44.83 0 top
R81  25.02,44.83 0 top
R82  33.15,43.05 180 top
R83  22.86,43.05 180 top
R84  33.15,45.09 180 top
R85  14.86,48.39 0 top
R86  19.94,48.39 0 top
R87  25.02,48.39 0 top
R88  33.15,46.61 180 top
R89  22.86,46.61 180 top
R90  33.15,48.64 180 top
R91  14.86,51.94 0 top
R92  19.94,51.94 0 top
R93  25.02,51.94 0 top
R94  33.15,50.16 180 top
R95  22.86,50.16 180 top
R96  33.15,52.2 180 top
U$1  10.66,75.56 0 top
U$2  80.64,81.92 180 top

### Tracks (layer width: path | path; a pad name or v marks a point on that pad's centre or on a via)
5VDC
  Top 0.279: 46.67,68.33 46.67,68.2 48.77,68.2 49.02,68.2 | 63.63,61.85 63.75,61.72 | 65.66,61.72 65.91,61.72 JP9.2 | D2.2 46.67,71.82 46.67,72.14
  Top 0.508: R2.2 85.62,73.98 85.62,73.26 85.24,72.87 84.69,72.87 84.28,73.28 83.57,73.28 83.57,75.42 74.96,84.02 74.96,84.43 U$2.JP2.8 69.22,89.79 71.17,87.83 71.17,77.86 69.67,76.36 68.75,76.36 62.75,82.36 62.75,84.97 57.79,89.93 53.07,89.93 U$1.OUT+
  Top 0.813: U$1.OUT+ 48.58,92.26 48.5,92.26 46.67,90.44 46.67,72.14 | D2.2 46.73,68.39 46.67,68.33 | JP4.1 46.86,68.2 48.77,68.2 | 49.02,68.2 57.28,68.2 63.63,61.85 | 63.75,61.72 65.66,61.72
A0IN
  Top 0.279: U$2.JP1.2 92.01,75.06 91.06,74.11 88.96,74.11 74.87,60.01 68.64,60.01 66.93,58.29 66.93,56.33 66.69,56.09 64.97,56.09 R15.1
  Top 0.813: R15.1 R16.2
C0  (via drill 0.2)
  Top 0.279: C5.1 23.05,5.52 23.43,5.52 24.57,4.38 25.53,4.38 v25.72,4.57 25.91,4.76 25.91,5.52 R3.1
  Bottom 0.279: v25.72,4.57 37.91,4.57 41.15,1.33 49.34,1.33 51.82,3.81 88.96,3.81 90.11,4.95 JP6.46
C1
  Top 0.61: R13.1 33.91,12.97 C4.1 35.63,12.97 38.71,9.89 38.71,5.63 41.8,2.54 JP5.47
  Bottom 0.279: JP5.47 41.91,2.67 42.29,2.67 43.24,3.62 44.96,3.62 47.43,6.1 47.43,62.36 40.45,69.34 JP12.9
C2  (1 unrouted)
  Top 0.61: R32.1 33.91,16.52 C8.1 35.42,16.52 40.58,11.37 | JP5.43 40.7,8.83 40.7,11.25 40.65,11.31
  Bottom 0.279: JP5.43 43.05,8.76 45.15,8.76 47.05,10.67 47.05,62.17 41.53,67.69 38.35,67.69 JP12.7
C3
  Top 0.61: R26.1 33.91,20.08 C7.1 35.42,20.08 41.91,13.59 JP5.39
  Bottom 0.279: JP5.39 41.91,12.57 43.43,14.1 45.34,14.1 46.67,15.43 46.67,61.98 41.34,67.31 35.81,67.31 34.16,68.96 JP12.5
C4
  Top 0.61: R38.1 33.91,23.64 C9.1 36.05,23.64 JP5.35
  Bottom 0.279: JP5.35 41.91,17.91 42.29,17.91 43.24,18.86 44.96,18.86 46.29,20.19 46.29,61.78 41.15,66.93 33.91,66.93 31.62,69.22 JP12.3
C5
  Top 0.61: R44.1 33.91,27.19 C10.1 37.58,27.19 JP5.31
  Bottom 0.279: JP5.31 43.18,24.13 45.09,24.13 45.85,24.89 45.85,60.96 45.83,60.97 45.83,61.64 40.92,66.55 31.88,66.55 JP12.1
C6
  Top 0.61: R50.1 33.91,30.75 C11.1 39.1,30.75 JP5.27
  Bottom 0.279: JP5.27 43.18,29.21 44.83,29.21 45.45,29.83 45.45,61.48 40.77,66.17 30.73,66.17 28.07,68.83 28.07,70.87 JP12.2 JP12.4 JP12.6 JP12.8 JP12.10
C7  (via drill 0.35)
  Top 0.279: v23.5,64.65 23.5,69.34 JP11.9
  Top 0.61: R66.1 33.91,34.3 C12.1 40.62,34.3 JP5.23
  Bottom 0.279: JP5.23 39.88,35.05 39.88,48.51 23.74,64.65 v23.5,64.65
C8  (via drill 0.35)
  Top 0.279: v20.95,66.69 JP11.7
  Top 0.61: R72.1 33.91,37.86 C13.1 41.67,37.86 JP5.19
  Bottom 0.279: JP5.19 40.26,39.75 40.26,48.77 22.23,66.8 21.07,66.8 v20.95,66.69
C9  (via drill 0.35)
  Top 0.279: v18.41,67.31 JP11.5
  Top 0.61: R78.1 33.91,41.42 C14.1 40.15,41.42 JP5.15
  Bottom 0.279: JP5.15 40.64,44.45 40.64,48.96 22.29,67.31 v18.41,67.31
C10  (via drill 0.35)
  Top 0.279: v15.88,67.71 JP11.3
  Top 0.61: R84.1 33.91,44.97 C15.1 38.62,44.97 JP5.11
  Bottom 0.279: JP5.11 41.88,48.26 22.19,67.94 16.11,67.94 v15.88,67.71
C11
  Top 0.61: R90.1 33.91,48.53 C17.1 37.1,48.53 JP5.7
  Bottom 0.279: JP5.7 37.34,53.34 22.35,68.33 14.35,68.33 JP11.1
C12
  Top 0.61: R96.1 33.91,52.09 C20.1 35.56,52.09 41.9,58.42 JP5.3
  Bottom 0.279: JP5.3 41.91,58.29 41.85,58.36 32.96,58.36 24.51,66.8 24.51,70.87 JP11.10 JP11.8 JP11.6 JP11.4 JP11.2
CSB
  Bottom 0.279: U$2.JP1.7 92.2,87.63 92.2,87.25 93.53,85.92 93.53,46.48 90.3,43.24 JP6.16
GND  (via drill 0.35)
  Top 0.61: R11.2 v19.94,11.05 15.21,11.05 R7.1 | C4.2 34.91,12.06 v33.02,12.06
  Top 0.813: R7.1 7.62,12.83 JP1.1 | C3.- 96.77,29.59 C16.2
  Top 1.016: 8.13,5.34 8.13,6.59
  Bottom 0.61: v33.02,12.06 32,11.05 v19.94,11.05
  other vias: 66.42,59.44 68.58,58.55 68.83,52.45 59.82,51.18 68.45,20.45 66.17,20.95 66.17,30.35 68.58,30.23 74.93,34.67 68.45,40.64 66.29,40.77 76.2,44.83 63.63,45.59 58.04,57.28 51.18,63.88 53.85,65.66 60.07,59.05 60.45,62.61 56.77,66.8 56.64,69.47 49.4,69.34 48.9,72.64 53.47,72.39 53.98,74.93 54.61,82.55 57.53,73.28 59.56,69.85 63.12,60.96 65.79,63.75 65.02,69.22 75.69,63.5 80.64,68.58 81.92,73.66 78.36,76.2 73.03,70.48 73.53,58.67 79.63,62.87 83.31,66.93 86.23,69.85 88.77,72.39 89.15,65.66 86.36,63.5 91.95,70.1 92.08,63.75 95.76,64.39 95.5,70.48 95.12,75.06 95.12,79.25 89.15,76.71 88.77,82.42 88.77,87.38 82.8,84.33 82.68,79.12 75.69,84.33 65.79,84.96 67.18,93.09 60.71,85.34 58.8,93.34 58.8,87.88 58.8,97.54 49.4,88.65 49.78,80.77 44.7,81.03 44.96,89.66 37.47,82.04 43.05,68.71 26.54,93.09 19.68,89.92 31.88,77.6 29.84,64.26 35.56,65.15 24.77,61.98 28.83,57.91 26.8,67.44 33.15,62.23 35.05,57.66 34.04,53.34 39.24,65.53 75.69,12.45 73.79,10.29 73.15,82.17 69.47,67.06 26.16,83.69 31.37,87.88 42.29,75.69 15.62,94.87 68.96,45.47 65.28,48.51 75.44,38.1 44.96,72.39 45.47,65.91 41.15,70.74 35.56,72.64 30.48,72.64 37.72,74.8 34.16,74.68 29.72,74.68 26.54,72.39 23.5,74.68 19.68,72.64 15.75,75.06 12.06,70.61 31.37,53.34 41.91,62.99 48.9,62.87 21.59,65.41 14.99,66.42 37.21,59.44 36.96,62.48 37.85,55.88 39.5,52.2 40.51,50.67 22.23,70.48 30.35,70.36 14.86,48.9 14.86,45.34 14.86,41.78 14.86,38.23 14.86,34.67 14.86,31.11 14.86,27.56 14.86,24 14.86,20.45 14.86,16.89
  pour Top (no thermals): -3.17,-1.91 -3.17,104.78 103.5,104.78 103.5,-1.91
  pour Bottom (no thermals): -3.17,102.87 -3.17,-2.54 102.23,-2.54 102.23,102.87
GPIO1
  Top 0.279: JP6.44 90.3,7.62 88.96,8.95 88.39,8.95 88.2,8.76 77.34,8.76 67.25,18.86 67.25,54.99 67.18,55.05 67.18,55.13
  Top 0.813: R59.1 67.18,55.13 R60.2
ICMP
  Top 0.279: JP6.6 90.11,55.82 90.11,53.34 JP6.8 90.26,53.43 R6.1
IMB
  Top 0.813: R5.2 91.04,59.29 JP6.4
IPB
  Top 0.813: R5.1 90.54,60.59 JP6.2
MISO  (via drill 0.2)
  Top 0.279: R61.2 84.96,78.11 84.96,75.06 R2.1 84.96,74.87 v84.96,73.53
  Bottom 0.279: v84.96,73.53 84.96,68.2 91.63,61.53 91.63,52.2 90.3,50.86 JP6.10
MOSI  (via drill 0.2)
  Top 0.279: R62.2 84.96,85.72 84.96,82.68 R1.1 84.77,82.49 v84.77,81.53
  Bottom 0.279: v84.77,81.53 84.77,74.3 84.39,73.91 84.39,52.01 87.06,49.34 89.15,49.34 90.11,48.39 JP6.12
N$1
  Top 0.279: LED1.A 61.72,89.15 62.1,89.15 62.48,89.53 64.39,89.53 65.15,88.77 65.15,88.39 R53.1
N$2
  Top 0.279: LED2.A 61.72,92.2 62.1,92.2 62.67,92.77 64.39,92.77 65.15,92.01 65.15,91.44 R54.1
N$3
  Top 0.279: LED3.A 61.72,95.44 62.1,95.44 62.48,95.82 64.39,95.82 65.15,95.06 65.15,94.68 R55.1
N$4
  Top 0.279: LED4.A 61.72,98.49 61.72,98.11 62.29,97.54 62.29,96.77 62.87,96.2 64.01,96.2 65.15,97.35 65.15,97.73 R56.1
N$5
  Top 0.279: U$2.JP1.1 95.06,72.39 96.97,74.3 JP3.2
N$6
  Top 0.279: JP3.1 97.16,77.03 96.84,77.34 92.2,77.34 U$2.JP1.3
N$7
  Top 0.813: JP7.24 JP5.48
N$8
  Top 0.813: JP5.46 JP7.23
N$9
  Top 0.813: JP5.44 JP7.22
N$10
  Top 0.813: JP7.21 JP5.42
N$11
  Top 0.813: JP5.40 JP7.20
N$12
  Top 0.813: JP5.38 JP7.19
N$13
  Top 0.813: JP7.18 JP5.36
N$17
  Top 1.27: R7.2 R8.1
N$18
  Top 1.27: R8.2 R9.1
N$21
  Top 0.813: JP5.34 JP7.17
N$23
  Top 0.61: LED5.A 26.66,12.61 R9.2
  Top 0.813: Q1.3 27.2,12.06 R9.2
N$24
  Top 0.813: JP5.32 JP7.16
N$25
  Top 0.61: R10.2 30.35,11.05 Q1.1
N$26
  Top 0.61: LED5.C R11.1
N$27
  Top 1.27: R17.2 R18.1
N$28
  Top 1.27: R18.2 R19.1
N$29
  Top 0.61: LED7.A 26.66,19.72 R19.2
  Top 0.813: Q2.3 27.2,19.18 R19.2
N$30  (via drill 0.2)
  Top 0.279: v63.44,96.77 63.44,97.73 R56.2
  Bottom 0.279: v63.44,96.77 63.44,91.25 68.77,85.92 68.77,85.72 69.34,85.15 U$2.JP2.6
N$31
  Top 0.61: R24.2 30.35,18.16 Q2.1
N$32
  Top 0.61: LED7.C R25.1
N$33
  Top 1.27: R27.2 R28.1
N$34
  Top 1.27: R28.2 R29.1
N$35
  Top 0.61: LED8.A 26.66,16.17 R29.2
  Top 0.813: Q4.3 27.2,15.62 R29.2
N$36
  Top 0.61: R30.2 30.35,14.61 Q4.1
N$37
  Top 0.61: LED8.C R31.1
N$38
  Top 1.27: R33.2 R34.1
N$39
  Top 1.27: R34.2 R35.1
N$40
  Top 0.61: LED9.A 26.66,23.28 R35.2
  Top 0.813: Q5.3 27.2,22.73 R35.2
N$41
  Top 0.61: R36.2 30.35,21.72 Q5.1
N$42
  Top 0.61: LED9.C R37.1
N$43
  Top 1.27: R39.2 R40.1
N$44
  Top 1.27: R40.2 R41.1
N$45
  Top 0.61: LED10.A 26.66,26.83 R41.2
  Top 0.813: Q6.3 27.2,26.29 R41.2
N$46
  Top 0.61: R42.2 30.35,25.27 Q6.1
N$47
  Top 0.61: LED10.C R43.1
N$48
  Top 1.27: R45.2 R46.1
N$49
  Top 1.27: R46.2 R47.1
N$50
  Top 0.61: LED11.A 26.66,30.39 R47.2
  Top 0.813: Q7.3 27.2,29.84 R47.2
N$51
  Top 0.61: R48.2 30.35,28.83 Q7.1
N$52
  Top 0.61: LED11.C R49.1
N$53
  Top 1.27: R51.2 R52.1
N$54
  Top 1.27: R52.2 R63.1
N$55
  Top 0.61: LED12.A 26.66,33.95 R63.2
  Top 0.813: Q8.3 27.2,33.4 R63.2
N$56
  Top 0.61: R64.2 30.35,32.38 Q8.1
N$57
  Top 0.61: LED12.C R65.1
N$58
  Top 1.27: R67.2 R68.1
N$59
  Top 1.27: R68.2 R69.1
N$60
  Top 0.61: LED13.A 26.66,37.5 R69.2
  Top 0.813: Q9.3 27.2,36.96 R69.2
N$61
  Top 0.813: JP7.15 JP5.30
N$62
  Top 0.61: R70.2 30.35,35.94 Q9.1
N$63
  Top 0.61: LED13.C R71.1
N$64
  Top 1.27: R73.2 R74.1
N$65
  Top 1.27: R74.2 R75.1
N$66
  Top 0.61: LED14.A 26.66,41.06 R75.2
  Top 0.813: Q10.3 27.2,40.51 R75.2
N$67
  Top 0.61: R76.2 30.35,39.5 Q10.1
N$68
  Top 0.61: LED14.C R77.1
N$69
  Top 1.27: R79.2 R80.1
N$70
  Top 0.279: R53.2 63.25,88.2 63.25,83.82 68.77,78.3 68.77,78.11 69.34,77.53 U$2.JP2.3
N$71
  Top 1.27: R80.2 R81.1
N$72
  Top 0.61: LED15.A 26.66,44.61 R81.2
  Top 0.813: Q11.3 27.2,44.07 R81.2
N$73
  Top 0.279: R61.1 87.25,78.11 91.25,82.11 91.44,82.11 92.01,82.68 U$2.JP1.5
N$74
  Top 0.813: JP5.28 JP7.14
N$75
  Top 0.813: JP7.13 JP5.26
N$76
  Top 0.813: JP5.24 JP7.12
N$77
  Top 0.813: JP5.22 JP7.11
N$78
  Top 0.813: JP7.10 JP5.20
N$79
  Top 0.61: R82.2 30.35,43.05 Q11.1
N$80
  Top 0.61: LED15.C R83.1
N$81
  Top 1.27: R85.2 R86.1
N$82
  Top 1.27: R86.2 R87.1
N$83
  Top 0.61: LED16.A 26.66,48.17 R87.2
  Top 0.813: Q12.3 27.2,47.62 R87.2
N$84
  Top 0.813: JP5.18 JP7.9
N$85
  Top 0.813: JP7.8 JP5.16
N$86
  Top 0.813: JP5.14 JP7.7
N$87
  Top 0.813: JP7.6 JP5.12
N$88
  Top 0.813: JP5.10 JP7.5
N$89
  Top 0.813: JP7.4 JP5.8
N$90
  Top 0.813: JP5.6 JP7.3
N$91
  Top 0.813: JP7.2 JP5.4
N$92
  Top 0.813: JP8.24 JP6.47
N$93
  Top 0.813: JP6.45 JP8.23
N$94
  Top 0.813: JP8.22 JP6.43
N$95
  Top 0.813: JP6.41 JP8.21
N$96
  Top 0.813: JP8.20 JP6.39
N$97
  Top 0.813: JP6.37 JP8.19
N$98
  Top 0.813: JP8.18 JP6.35
N$99
  Top 0.813: JP6.33 JP8.17
N$100
  Top 0.813: JP8.16 JP6.31
N$101
  Top 0.813: JP6.29 JP8.15
N$102
  Top 0.813: JP8.14 JP6.27
N$103
  Top 0.813: JP6.25 JP8.13
N$104
  Top 0.813: JP8.12 JP6.23
N$105
  Top 0.813: JP6.21 JP8.11
N$107
  Top 0.813: JP8.10 JP6.19
N$108
  Top 0.813: JP6.17 JP8.9
N$109
  Top 0.813: JP8.8 JP6.15
N$110
  Top 0.813: JP6.13 JP8.7
N$111
  Top 0.813: JP8.6 JP6.11
N$112
  Top 0.813: JP6.9 JP8.5
N$113
  Top 0.813: JP8.4 JP6.7
N$114
  Top 0.813: JP6.5 JP8.3
N$115
  Top 0.813: JP8.2 JP6.3
N$116
  Top 0.813: JP6.1 JP8.1
N$117
  Top 0.279: R1.2 86.68,82.49 86.68,79.63 85.72,78.68 85.72,77.53 87.06,76.2 87.25,76.2 87.82,75.63 87.82,74.11 75.44,61.72 68.58,61.72 JP9.1
N$118
  Top 0.813: JP5.2 JP7.1
N$119
  Top 0.279: R62.1 91.25,85.72 92.01,84.96 U$2.JP1.6
N$120
  Top 0.279: R55.2 63.44,94.49 63.44,93.73 64.01,93.15 65.34,93.15 67.82,90.68 67.82,89.53 68.58,88.77 69.53,88.77 70.67,87.63 70.67,84.58 69.34,83.25 69.34,82.68 U$2.JP2.5
N$122
  Top 0.61: R88.2 30.35,46.61 Q12.1
N$123
  Top 0.61: LED16.C R89.1
N$124
  Top 0.279: U$2.JP2.4 68.96,80.01 67.82,81.15 67.82,87.44 65.34,89.92 64.01,89.92 63.44,90.49 63.44,91.44 R54.2
N$125
  Top 1.27: R91.2 R92.1
N$126
  Top 1.27: R92.2 R93.1
N$127
  Top 0.61: LED17.A 26.66,51.73 R93.2
  Top 0.813: Q13.3 27.2,51.18 R93.2
N$128
  Top 0.61: R94.2 30.35,50.16 Q13.1
N$129
  Top 0.61: LED17.C R95.1
P2  (via drill 0.35)
  Top 0.61: R13.2 32.48,13.06 Q1.2 30.37,13.06 v31.37,12.06 | R31.2 15.21,14.61 13.7,16.12 R27.1 | C8.2 34.91,15.62 v33.02,15.62
  Top 1.016: JP1.2 2.64,18.01 2.48,18.01 1.68,17.2 1.68,15.47 8.26,8.89 D3.1 | JP14.12 10.77,19.05 13.7,16.12
  Bottom 0.61: v33.02,15.62 33.02,13.72 v31.37,12.06
  Bottom 1.016: JP1.2 4.98,18.01 5.14,18.01 5.62,17.53 7.49,17.53 | 7.49,17.53 8.51,17.53 JP14.12 | 7.49,17.53 12.95,12.06 v31.37,12.06
P3  (via drill 0.35)
  Top 0.61: R32.2 32.48,16.62 Q4.2 30.37,16.62 v31.37,15.62 | R25.2 15.21,18.16 13.7,19.67 R17.1 | C7.2 34.91,19.18 v33.02,19.18
  Top 1.016: JP14.10 11.79,21.59 13.7,19.67
  Bottom 0.61: v33.02,19.18 33.02,17.27 v31.37,15.62
  Bottom 0.813: 6.82,20.32 8.76,20.32 JP14.10
  Bottom 1.016: v31.37,15.62 14.35,15.62 12.06,17.91 12.06,19.56 JP14.10 | JP1.3 4.98,20.55 5.14,20.55 5.37,20.32 6.82,20.32
P4  (via drill 0.35)
  Top 0.61: R26.2 32.48,20.18 Q2.2 30.37,20.18 v31.37,19.18 | R37.2 15.21,21.72 R33.1 | C9.2 34.91,22.73 v33.02,22.73
  Top 1.016: JP14.8 12.8,24.13 R33.1
  Bottom 0.61: v33.02,22.73 33.02,20.83 v31.37,19.18
  Bottom 0.813: 6.78,22.81 6.92,22.81 6.97,22.86 8.76,22.86 JP14.8
  Bottom 1.016: v31.37,19.18 14.73,19.18 10.03,23.88 JP14.8 | JP1.4 5.33,24.26 6.78,22.81
P5  (via drill 0.35)
  Top 0.61: R38.2 32.48,23.73 Q5.2 30.37,23.73 v31.37,22.73 | R43.2 15.21,25.27 R39.1 | C10.2 34.91,26.29 v33.02,26.29
  Top 1.016: JP14.6 13.06,26.67 R39.1
  Bottom 0.61: v33.02,26.29 33.02,24.38 v31.37,22.73
  Bottom 0.813: 6.82,25.4 8.76,25.4 JP14.6
  Bottom 1.016: v31.37,22.73 13.97,22.73 JP14.6 | JP1.5 5.43,26.8 6.82,25.4
P6  (via drill 0.35)  (1 unrouted)
  Top 0.61: R44.2 32.48,27.29 Q6.2 30.37,27.29 v31.37,26.29 | R49.2 15.21,28.83 R45.1 | C11.2 34.91,29.84 v33.02,29.84
  Top 0.813: R45.1 13.23,30.61
  Top 1.016: JP14.4 11.43,30.61 R45.1
  Bottom 0.61: v33.02,29.84 33.02,27.94 v31.37,26.29
  Bottom 0.813: JP14.4 8.76,27.94 6.82,27.94
  Bottom 1.016: v31.37,26.29 13.08,26.29 10.03,29.34 | JP1.6 5.43,29.34 6.82,27.94
P7  (via drill 0.35)
  Top 0.61: R50.2 32.48,30.84 Q7.2 30.37,30.84 v31.37,29.84 | R65.2 15.21,32.38 R51.1 | C12.2 34.91,33.4 v33.02,33.4
  Top 0.813: JP14.11 JP14.9 JP14.7 JP14.5 JP14.3
  Top 1.016: JP14.2 12.45,34.16 R51.1
  Bottom 0.61: v33.02,33.4 33.02,31.5 v31.37,29.84
  Bottom 1.016: v31.37,29.84 11.94,29.84 JP14.2 JP14.3 4.83,31.88 JP1.7
P8  (via drill 0.35)
  Top 0.61: R66.2 32.48,34.4 Q8.2 30.37,34.4 v31.37,33.4 | R71.2 15.21,35.94 R67.1 | C13.2 34.91,36.96 v33.02,36.96
  Top 1.016: JP13.10 13.34,37.72 R67.1
  Bottom 0.61: v33.02,36.96 33.02,35.05 v31.37,33.4
  Bottom 0.813: 6.89,33.08 8.7,33.08 JP13.10
  Bottom 1.016: 6.89,33.08 5.3,33.08 5.14,33.25 4.98,33.25 JP1.8 | JP13.10 10.29,34.42 11.3,33.4 v31.37,33.4
P9  (via drill 0.35)
  Top 0.61: R72.2 32.48,37.96 Q9.2 30.37,37.96 v31.37,36.96 | R77.2 15.21,39.5 R73.1 | C14.2 34.91,40.51 v33.02,40.51
  Top 0.813: 13.44,40.87 R73.1
  Top 1.016: JP13.8 11.56,38.48 11.56,38.99 13.44,40.87
  Bottom 0.61: v33.02,40.51 33.02,38.61 v31.37,36.96
  Bottom 0.813: 6.82,35.69 8.76,35.69 JP13.8
  Bottom 1.016: JP1.9 5.55,36.96 6.82,35.69 | JP13.8 v31.37,36.96
P10  (via drill 0.35)
  Top 0.61: R78.2 32.48,41.51 Q10.2 30.37,41.51 v31.37,40.51 | R83.2 15.21,43.05 R79.1 | C15.2 34.91,44.07 v33.02,44.07
  Top 1.016: JP13.6 11.43,40.89 11.43,42.04 13.44,44.04 R79.1
  Bottom 0.61: v33.02,44.07 33.02,42.47 31.22,40.66
  Bottom 0.813: 6.82,38.23 8.76,38.23 JP13.6
  Bottom 1.016: v31.37,40.51 31.22,40.66 11.2,40.66 JP13.6 | 6.82,38.23 5.55,39.5 JP1.10
P11  (via drill 0.35)
  Top 0.61: R84.2 32.48,45.07 Q11.2 30.37,45.07 v31.37,44.07 | R89.2 15.21,46.61 R85.1 | C17.2 34.91,47.62 v33.02,47.62
  Top 1.016: JP13.4 10.03,42.29 11.77,44.03 11.77,46.72 R85.1
  Bottom 0.61: v33.02,47.62 33.02,45.72 v31.37,44.07
  Bottom 0.813: JP13.4 8.76,40.77 6.82,40.77
  Bottom 1.016: v31.37,44.07 12.06,44.07 JP13.4 | JP1.11 5.55,42.04 6.82,40.77
P12  (via drill 0.35)
  Top 0.61: R90.2 32.48,48.62 Q12.2 30.37,48.62 v31.37,47.62 | R95.2 15.21,50.16 R91.1 | C20.2 34.91,51.18 v33.02,51.18
  Top 1.016: JP13.2 10.03,48.54 R91.1
  Bottom 0.61: v33.02,51.18 33.02,49.28 v31.37,47.62
  Bottom 0.813: 6.82,43.31 8.76,43.31 JP13.2
  Bottom 1.016: v31.37,47.62 13.08,47.62 JP13.2 | JP1.12 5.55,44.58 6.82,43.31
P13  (via drill 0.35)
  Top 0.279: R4.2 34.48,60.96 34.32,60.8 | R59.2 R15.2 54.04,66.8 39.18,66.8
  Top 0.508: 39.18,66.8 35.16,62.79 R4.2 35.76,61.55 35.76,63.09 43.18,70.51 D2.1 21.59,93.34 U$1.IN+
  Top 0.61: R96.2 32.48,52.18 Q13.2 30.37,52.18 v31.37,51.18
  Top 0.813: R96.2 32.94,52.64 32.94,59.42 34.32,60.8 35.01,60.8 R4.2 | JP14.1 JP13.9 JP13.7 JP13.5 JP13.3 JP13.1
  Bottom 1.016: v31.37,51.18 14.1,51.18 JP13.1 4.95,47.12 JP1.13
S1
  Top 0.279: R10.1 33.97,10.99 36.77,10.99 38.07,9.68 38.07,4.96 41.49,1.54 42.33,1.54 42.91,2.12 42.91,2.53 44.01,3.62 44.96,3.62 45.15,3.81 52.01,3.81 52.2,4 54.48,4 54.67,3.81 77.34,3.81 77.53,4 79.82,4 80.01,3.81 86.87,3.81 87.06,4 88.2,4 88.58,3.62 89.15,3.62 90.11,2.67 JP6.48
S2
  Top 0.61: R30.1 34.55,14.61 34.69,14.47 35.2,14.47 38.17,11.5 39.47,10.2 39.47,7.39 41.78,5.08 JP5.45
S3  (1 unrouted)
  Top 0.61: R24.1 34.55,18.16 34.69,18.02 36.46,18.02 40.64,13.84 40.64,12.44 40.7,12.38 | JP5.41 41.91,11.05 40.64,12.32
S4
  Top 0.61: R36.1 34.55,21.72 34.69,21.58 35.57,21.58 JP5.37
S5
  Top 0.61: R42.1 34.55,25.27 34.69,25.14 37.09,25.14 JP5.33
S6
  Top 0.61: R48.1 34.55,28.83 34.69,28.69 38.62,28.69 JP5.29
S7
  Top 0.61: R64.1 34.55,32.38 34.69,32.25 40.14,32.25 JP5.25
S8
  Top 0.61: R70.1 34.55,35.94 34.69,35.8 41.66,35.8 JP5.21
S9
  Top 0.61: JP5.17 40.63,39.36 34.69,39.36 34.55,39.5 R76.1
S10
  Top 0.61: R82.1 34.55,43.05 34.69,42.92 39.11,42.92 JP5.13
S11
  Top 0.61: R88.1 34.55,46.61 34.69,46.47 37.58,46.47 JP5.9
S12
  Top 0.61: R94.1 34.55,50.16 34.69,50.03 36.06,50.03 JP5.5
SCK
  Bottom 0.279: U$2.JP1.4 92.01,80.01 92.01,79.63 90.49,78.11 90.49,63.25 92.01,61.72 92.01,47.82 90.3,46.1 90.3,45.72 JP6.14
V+
  Top 0.279: 38.61,60.96 38.86,60.96 39.05,61.15 C21.1
  Top 0.813: R4.1 38.61,60.96 | C21.1 41.53,61.34 JP5.1
VREF1
  Top 0.279: 60.96,78.87 C1.+
  Top 0.813: C18.1 60.96,74.93 60.96,78.87
  Bottom 0.279: 57.44,74.96 60.96,78.49 C1.+ | 57.44,74.96 56.39,73.91 12.57,73.91 10.86,72.2 10.86,66.29 4,59.44 3.62,59.44 JP2.3 | JP6.28 88.96,29.15 86.87,29.15 80.96,35.05 80.96,38.67 80.39,39.24 77.34,39.24 64.58,52.01 64.58,67.82 57.44,74.96
VREF2
  Top 0.279: 61.15,71.44 C19.1
  Top 0.813: C2.+ 60.96,71.25 61.15,71.44
  Bottom 0.279: JP2.1 3.62,54.29 4,54.29 11.24,61.53 11.24,72.01 12.76,73.53 54.48,73.53 60.58,67.44 60.96,67.44 C2.+ 60.96,67.06 61.91,66.1 61.91,49.53 77.15,34.29 80.2,34.29 80.96,33.53 80.96,32.58 86.87,26.67 88.96,26.67 90.11,25.53 JP6.30
VREG  (via drill 0.2)
  Top 0.279: 65.41,53.53 v65.53,53.53
  Top 0.813: JP4.2 51.88,65.53 59.88,57.53 59.88,54.61 60.96,53.53 65.41,53.53
  Top 1.016: C3.+ 93.09,32.26 C16.1 90.8,32.39 JP6.24
  Bottom 0.279: 80.01,41.91 80.2,41.91 | 85.95,36.16 86.11,36.01
  Bottom 0.813: v65.53,53.53 65.74,53.53 77.36,41.91 80.01,41.91 | 80.2,41.91 85.95,36.16 | 86.11,36.01 86.11,35.18 87,34.29 88.9,34.29 JP6.24
VTEMP1
  Top 0.279: JP2.2 4.57,56.77 4.76,56.96 7.81,56.96 R57.2
VTEMP2
  Top 0.279: R58.2 7.81,62.1 5.14,62.1 4.95,61.91 3.62,61.91 JP2.4

### Text on the board
tNames: V+ | IPB | C12 | IMB | S12 | ICMP | C11 | IBIAS | S11 | MISO | C10 | MOSI | S10 | SCk | C9 | CSB | S9 | ISOMD | C8 | WDT | S8 | DRIVE | C7 | VREG | S7 | SWTEN | C6 | VREF1 | S6 | VREF2 | C5 | GPIO5 | S5 | GPIO4 | C4 | GND | S4 | GND | C3 | GPIO3 | S3 | GPIO2 | C2 | GPIO1 | S2 | C0 | C1 | S1